# EAGLE schematic pandashield12-lga (EAGLE 6.0)

## Sheet 1 of 9
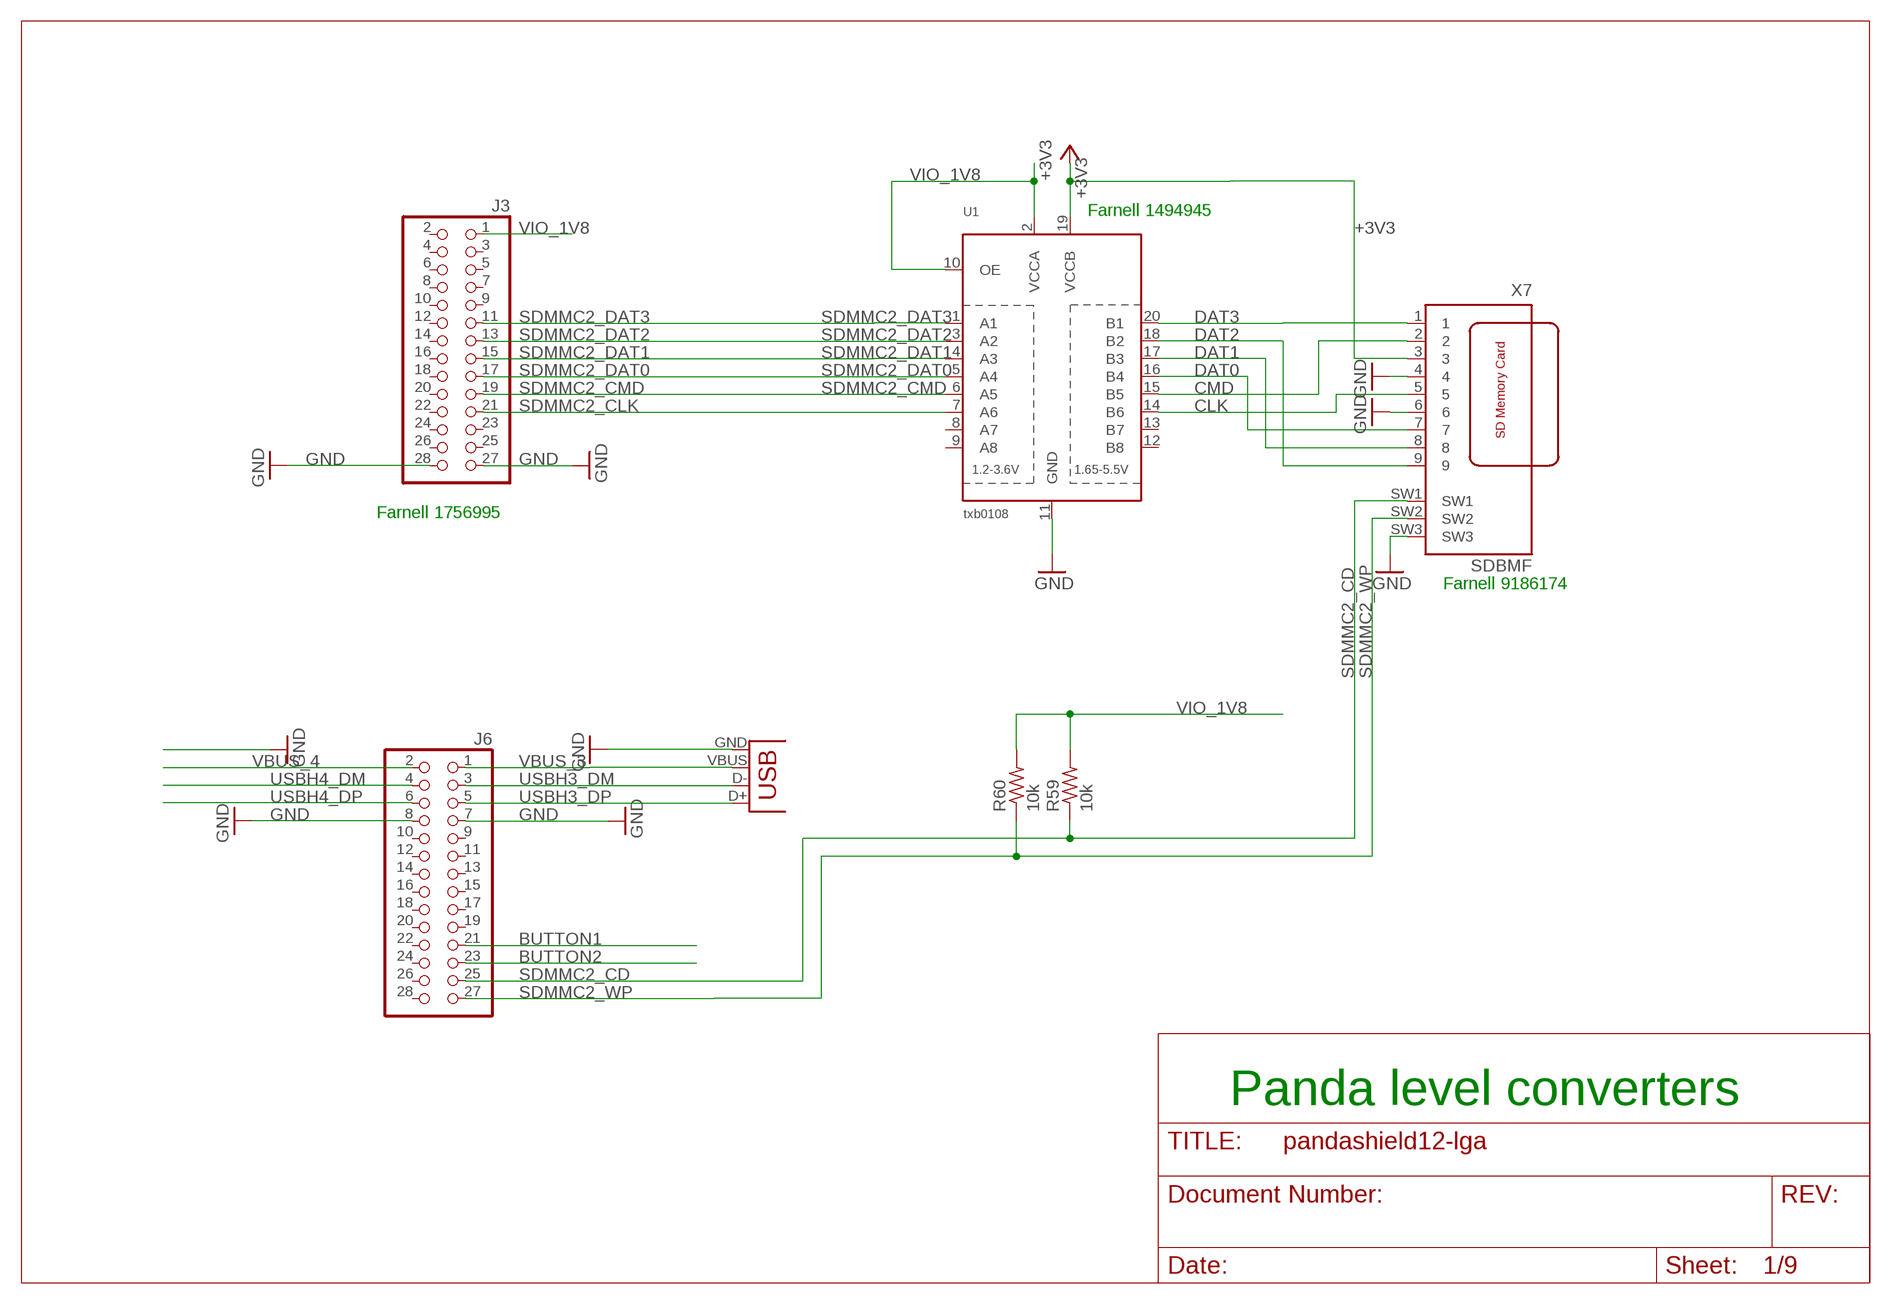
[diagram p0: schematic, sheet 1]

### Parts
J3  PINHD-2X14  [2X14]
J6  PINHD-2X14  [2X14]
R59  10k  R-US_R0603  [R0603]
R60  10k  R-US_R0603  [R0603]
U1  txb0108  TXB0108PWR  [TSSOP20]
X4  USB-A-S  [USB-A-S]
X7  SDBMF  [SDBMF-009XXBXX2]

### Nets
+3V3 [morepower]: U1.19(VCCB) X7.3 ; also sheet 2,4,5,6,7,8
BUTTON1: J6.21
BUTTON2: J6.23
CLK: U1.14(B6) X7.5
CMD: U1.15(B5) X7.2
DAT0: U1.16(B4) X7.7
DAT1: U1.17(B3) X7.8
DAT2: U1.18(B2) X7.9
DAT3: U1.20(B1) X7.1
GND [morepower]: J3.27 J3.28 J6.7 J6.8 U1.11(GND) X4.GND X7.4 X7.6 X7.SW3 ; also sheet 2,3,4,5,6,7,8,9
SDMMC2_CD: J6.25 R59.1 X7.SW1
SDMMC2_CLK: J3.21 U1.7(A6)
SDMMC2_CMD: J3.19 U1.6(A5)
SDMMC2_DAT0: J3.17 U1.5(A4)
SDMMC2_DAT1: J3.15 U1.4(A3)
SDMMC2_DAT2: J3.13 U1.3(A2)
SDMMC2_DAT3: J3.11 U1.1(A1)
SDMMC2_WP: J6.27 R60.1 X7.SW2
USBH3_DM: J6.3 X4.D-
USBH3_DP: J6.5 X4.D+
USBH4_DM: J6.4
USBH4_DP: J6.6
VBUS_3 [power]: J6.1 X4.VBUS
VBUS_4 [power]: J6.2
VIO_1V8 [power]: J3.1 R59.2 R60.2 U1.2(VCCA) U1.10(OE)
Unconnected: J3.2 J3.3 J3.4 J3.5 J3.6 J3.7 J3.8 J3.9 J3.10 J3.12 J3.14 J3.16 J3.18 J3.20 J3.22 J3.23 J3.24 J3.25 J3.26 J6.9 J6.10 J6.11 J6.12 J6.13 J6.14 J6.15 J6.16 J6.17 J6.18 J6.19 J6.20 J6.22 J6.24 J6.26 J6.28 U1.8(A7) U1.9(A8) U1.12(B8) U1.13(B7)

### Notes on the sheet
- Farnell 1494945
- Farnell 1756995
- Farnell 9186174
- Panda level converters

## Sheet 2 of 9
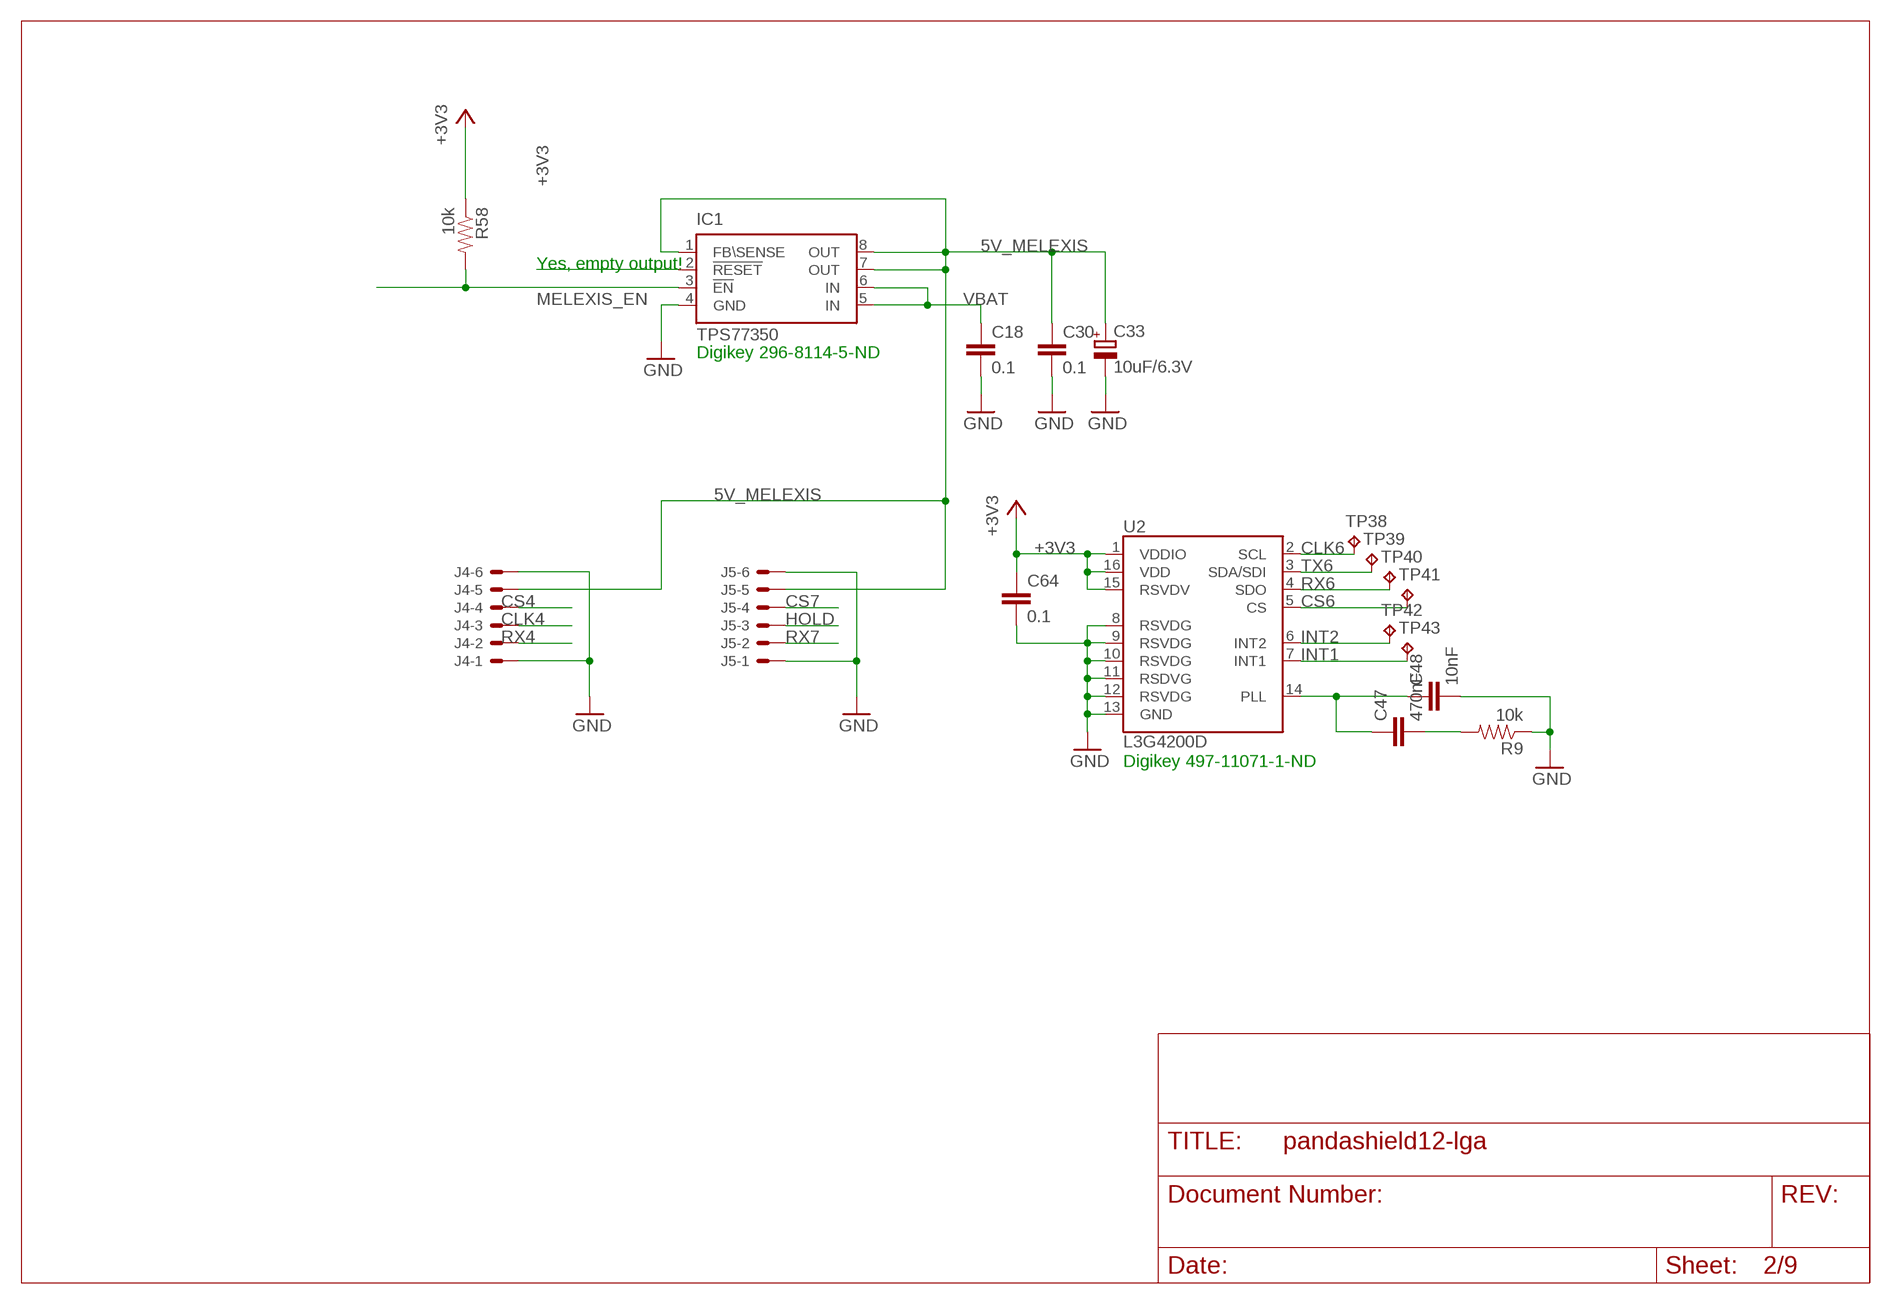
[diagram p1: schematic, sheet 2]

### Parts
C18  0.1  C-EUC0603  [C0603]
C30  0.1  C-EUC0603  [C0603]
C33  10uF/6.3V  CPOL-EUC/6032-28R  [C/6032-28R]
C47  470nF  CAP0603-CAP  [0603-CAP]
C48  10nF  CAP0603-CAP  [0603-CAP]
C64  0.1  CAP0603-CAP  [0603-CAP]
IC1  TPS77350  [SOP-08]
J4  XF2L-0625-1  [XF2L-0625-1]
J5  XF2L-0625-1  [XF2L-0625-1]
R9  10k  RESISTOR0603-RES  [0603-RES]
R58  10k  RESISTOR0603-RES  [0603-RES]
TP38  TPB1,27  [B1,27]
TP39  TPB1,27  [B1,27]
TP40  TPB1,27  [B1,27]
TP41  TPB1,27  [B1,27]
TP42  TPB1,27  [B1,27]
TP43  TPB1,27  [B1,27]
U2  L3G4200D  [LGA16-4X4]

### Nets
5V_MELEXIS [power]: C30.1 C33.+ IC1.1(FB\SENSE) IC1.7(OUT) IC1.8(OUT) J4.5 J5.5
+3V3 [morepower]: C64.1 R58.1 U2.1(VDDIO) U2.15(RSVDV) U2.16(VDD) ; also sheet 1,4,5,6,7,8
CLK4: J4.3 ; also sheet 6
CLK6: TP38.TP U2.2(SCL) ; also sheet 6
CS4: J4.4 ; also sheet 6
CS6: TP41.TP U2.5(CS) ; also sheet 6
CS7: J5.4 ; also sheet 6
GND [morepower]: C18.2 C30.2 C33.- C48.2 C64.2 IC1.4(GND) J4.1 J4.6 J5.1 J5.6 R9.1 U2.8(RSVDG) U2.9(RSVDG) U2.10(RSVDG) U2.11(RSDVG) U2.12(RSVDG) U2.13(GND) ; also sheet 1,3,4,5,6,7,8,9
HOLD: J5.3 ; also sheet 6
INT1: TP43.TP U2.7(INT1) ; also sheet 6
INT2: TP42.TP U2.6(INT2) ; also sheet 6
MELEXIS_EN: IC1.3(!EN) R58.2 ; also sheet 6
N$3: C47.1 C48.1 U2.14(PLL)
N$4: C47.2 R9.2
N$9: IC1.2(!RESET)
RX4: J4.2 ; also sheet 6
RX6: TP40.TP U2.4(SDO) ; also sheet 6
RX7: J5.2 ; also sheet 6
TX6: TP39.TP U2.3(SDA/SDI) ; also sheet 6
VBAT [morepower]: C18.1 IC1.5(IN) IC1.6(IN) ; also sheet 3,4,5,6,7,9

### Notes on the sheet
- Yes, empty output!
- Digikey 296-8114-5-ND
- Digikey 497-11071-1-ND

## Sheet 3 of 9
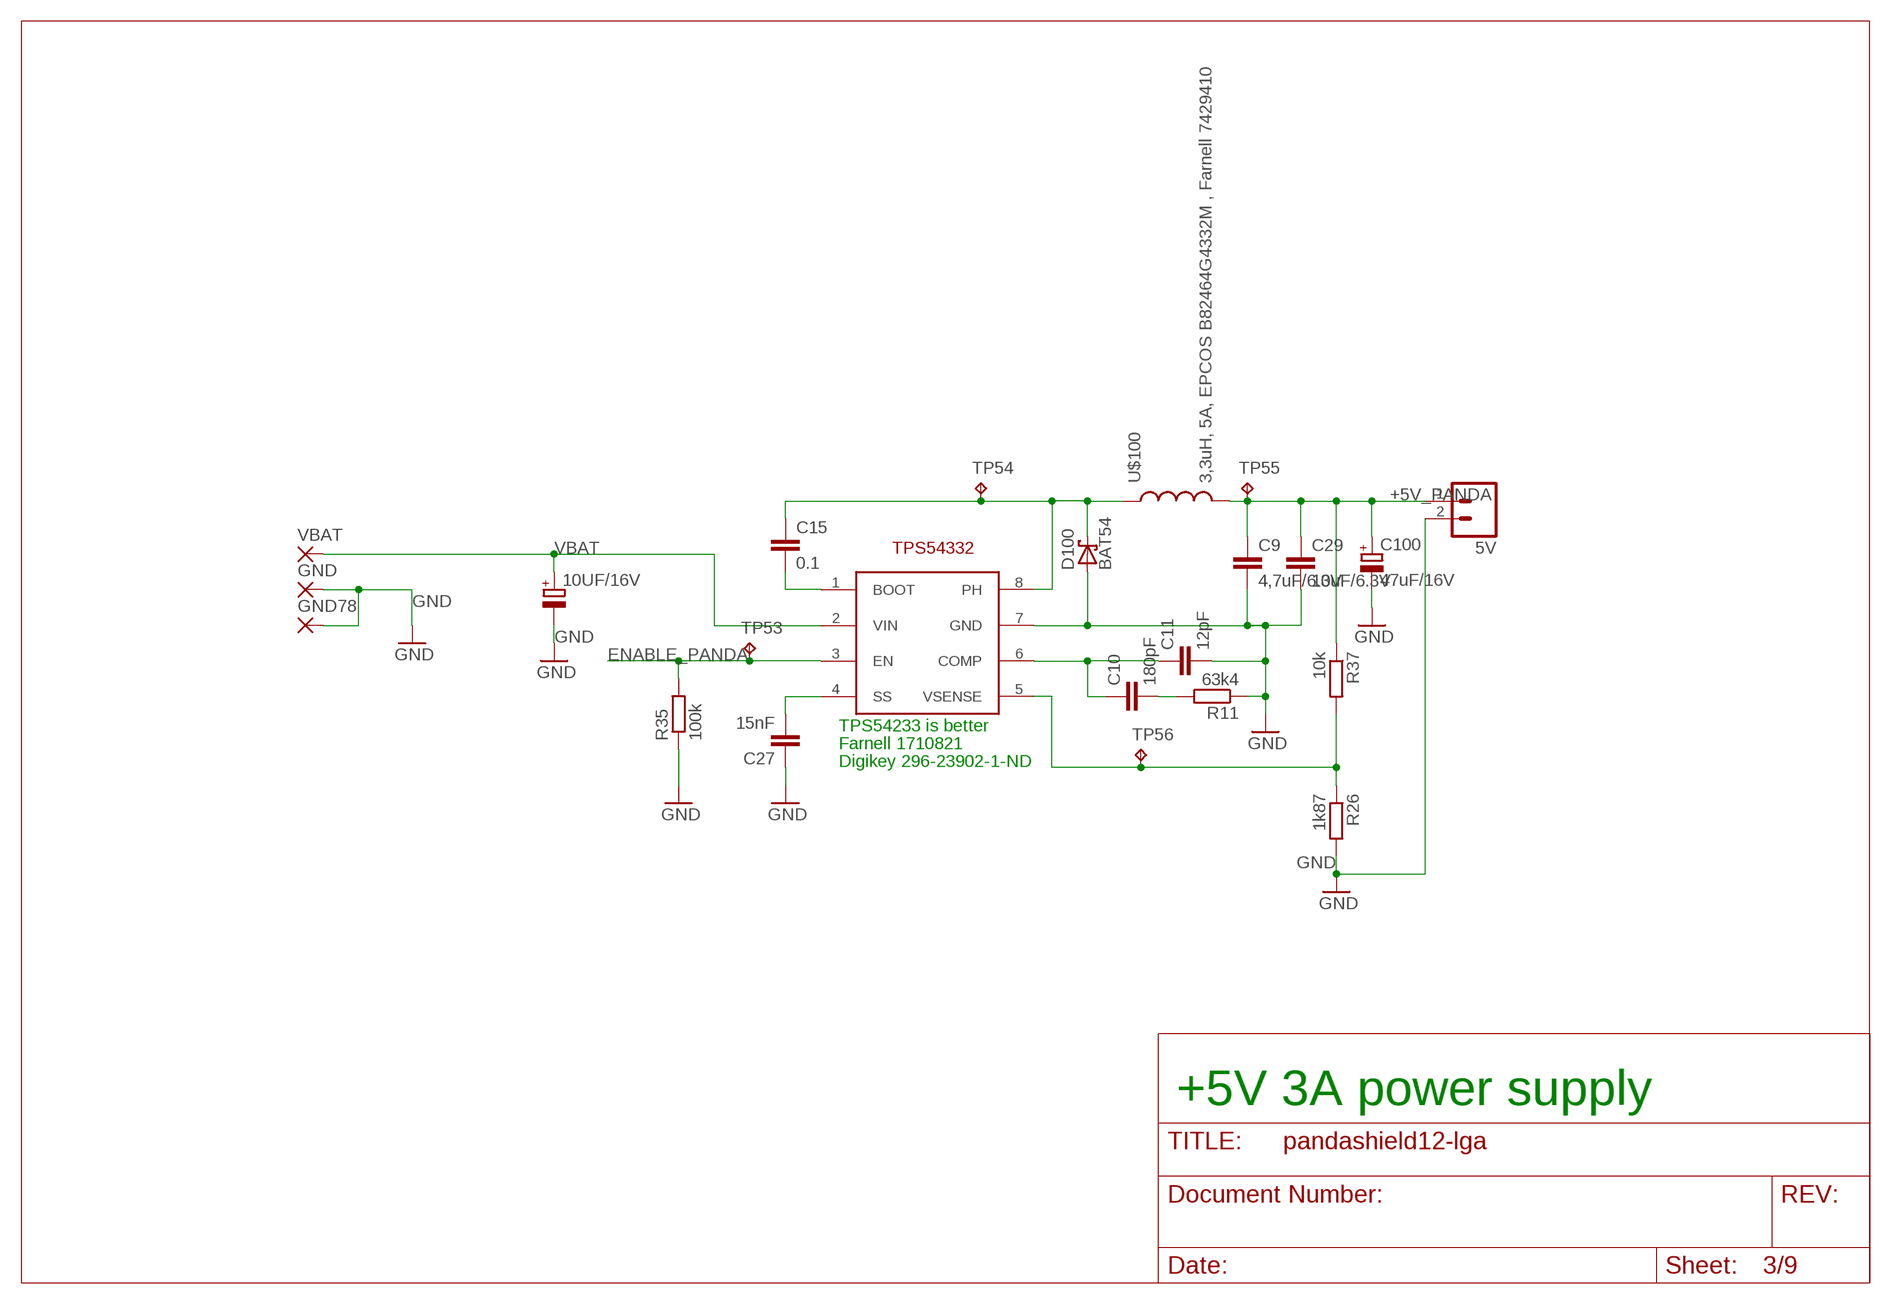
[diagram p2: schematic, sheet 3]

### Parts
5V  M02  [02P]
10UF/16V  CPOL-EUC/6032-28R  [C/6032-28R]
C9  4,7uF/6.3V  C-EUC0805  [C0805]
C10  180pF  C-EUC0805K  [C0805K]
C11  12pF  C-EUC0805K  [C0805K]
C15  0.1  C-EUC0805K  [C0805K]
C27  15nF  C-EUC0805K  [C0805K]
C29  10uF/6.3V  CAP1210  [1210]
C100  47uF/16V  CPOL-EUC/6032-28R  [C/6032-28R]
D100  BAT54  [SOT23]
GND  3,81/1,4  [3,81/1,4]
GND78  3,81/1,4  [3,81/1,4]
R11  63k4  R-EU_R0805  [R0805]
R26  1k87  R-EU_R0805  [R0805]
R35  100k  R-EU_R0805  [R0805]
R37  10k  R-EU_R0805  [R0805]
TP53  TPB1,27  [B1,27]
TP54  TPB1,27  [B1,27]
TP55  TPB1,27  [B1,27]
TP56  TPB1,27  [B1,27]
U$3  TPS54233  TPS54332  [SO8]
U$100  3,3uH, 5A, EPCOS B82464G4332M , Farnell 7429410  INDUCTORCR54  [CR54]
VBAT  3,81/1,4  [3,81/1,4]

### Nets
+5V_PANDA [morepower]: 5V.1 C9.1 C29.1 C100.+ R37.1 TP55.TP U$100.P$2
ENABLE_PANDA: R35.2 TP53.TP U$3.3(EN) ; also sheet 6
GND [morepower]: 5V.2 10UF/16V.- C9.2 C11.2 C27.1 C29.2 C100.- D100.1(A) GND78.1(P) GND.1(P) R11.1 R26.2 R35.1 U$3.7(GND) ; also sheet 1,2,4,5,6,7,8,9
N$6: C10.1 C11.1 U$3.6(COMP)
N$18: C10.2 R11.2
N$20: C27.2 U$3.4(SS)
N$30: C15.2 U$3.1(BOOT)
N$32: R26.1 R37.2 TP56.TP U$3.5(VSENSE)
N$33 [morepower]: C15.1 D100.3(C) TP54.TP U$3.8(PH) U$100.P$1
VBAT [morepower]: 10UF/16V.+ U$3.2(VIN) VBAT.1(P) ; also sheet 2,4,5,6,7,9

### Notes on the sheet
- TPS54233 is better
- Farnell 1710821
- Digikey 296-23902-1-ND
- +5V 3A power supply

## Sheet 4 of 9
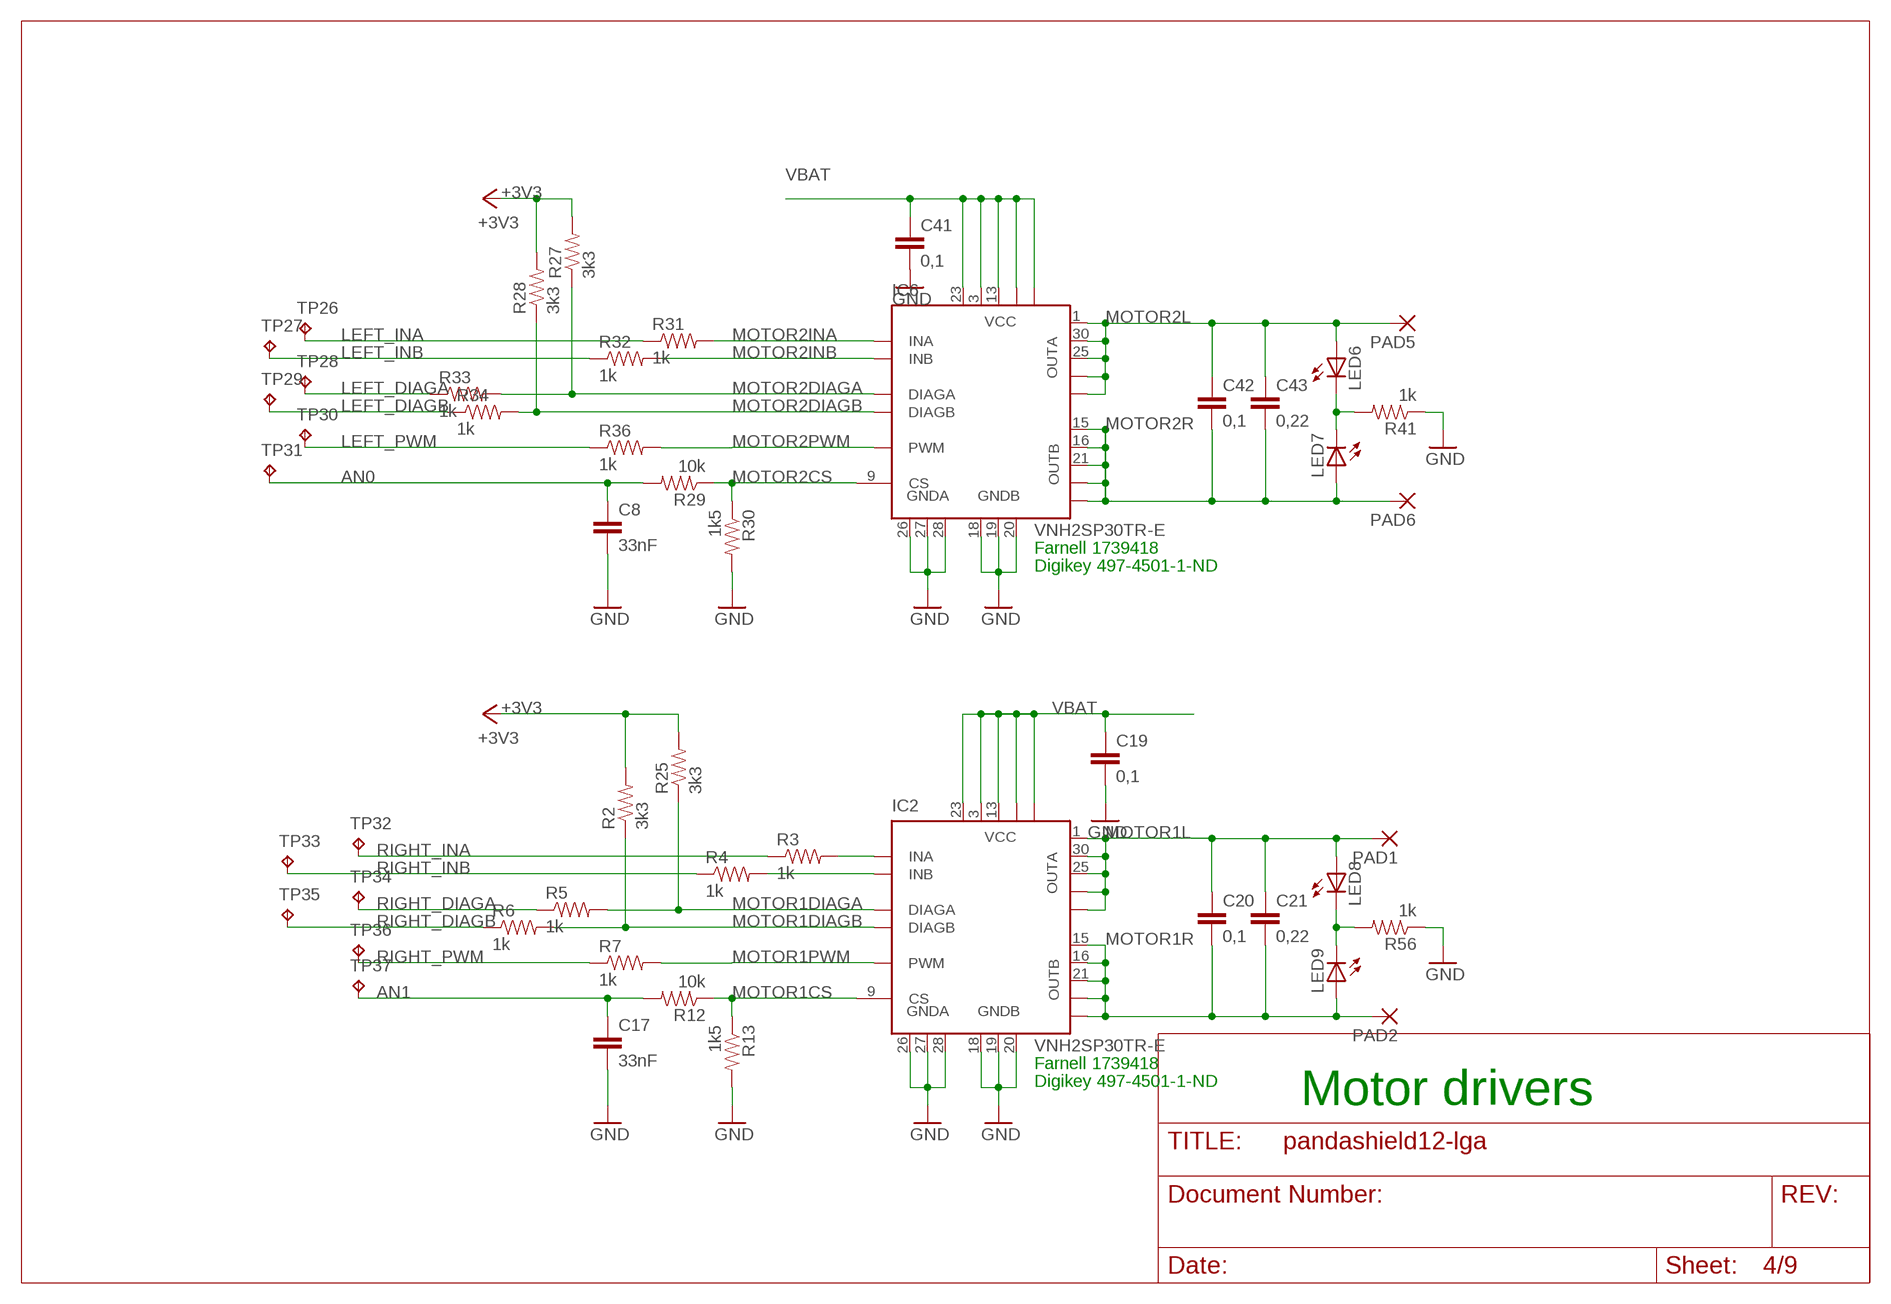
[diagram p3: schematic, sheet 4]

### Parts
C8  33nF  CAP0603-CAP  [0603-CAP]
C17  33nF  CAP0603-CAP  [0603-CAP]
C19  0,1  CAP0603-CAP  [0603-CAP]
C20  0,1  CAP0603-CAP  [0603-CAP]
C21  0,22  CAP0603-CAP  [0603-CAP]
C41  0,1  CAP0603-CAP  [0603-CAP]
C42  0,1  CAP0603-CAP  [0603-CAP]
C43  0,22  CAP0603-CAP  [0603-CAP]
IC2  VNH2SP30TR-E  VNH3ASP30-E  [MULTIPOWERSO-30]
IC6  VNH2SP30TR-E  VNH3ASP30-E  [MULTIPOWERSO-30]
LED6  LEDCHIP-LED0603  [CHIP-LED0603]
LED7  LEDCHIP-LED0603  [CHIP-LED0603]
LED8  LEDCHIP-LED0603  [CHIP-LED0603]
LED9  LEDCHIP-LED0603  [CHIP-LED0603]
PAD1  3,81/1,4  [3,81/1,4]
PAD2  3,81/1,4  [3,81/1,4]
PAD5  3,81/1,4  [3,81/1,4]
PAD6  3,81/1,4  [3,81/1,4]
R2  3k3  RESISTOR0603-RES  [0603-RES]
R3  1k  RESISTOR0603-RES  [0603-RES]
R4  1k  RESISTOR0603-RES  [0603-RES]
R5  1k  RESISTOR0603-RES  [0603-RES]
R6  1k  RESISTOR0603-RES  [0603-RES]
R7  1k  RESISTOR0603-RES  [0603-RES]
R12  10k  RESISTOR0603-RES  [0603-RES]
R13  1k5  RESISTOR0603-RES  [0603-RES]
R25  3k3  RESISTOR0603-RES  [0603-RES]
R27  3k3  RESISTOR0603-RES  [0603-RES]
R28  3k3  RESISTOR0603-RES  [0603-RES]
R29  10k  RESISTOR0603-RES  [0603-RES]
R30  1k5  RESISTOR0603-RES  [0603-RES]
R31  1k  RESISTOR0603-RES  [0603-RES]
R32  1k  RESISTOR0603-RES  [0603-RES]
R33  1k  RESISTOR0603-RES  [0603-RES]
R34  1k  RESISTOR0603-RES  [0603-RES]
R36  1k  RESISTOR0603-RES  [0603-RES]
R41  1k  RESISTOR0603-RES  [0603-RES]
R56  1k  RESISTOR0603-RES  [0603-RES]
TP26  TPB1,27  [B1,27]
TP27  TPB1,27  [B1,27]
TP28  TPB1,27  [B1,27]
TP29  TPB1,27  [B1,27]
TP30  TPB1,27  [B1,27]
TP31  TPB1,27  [B1,27]
TP32  TPB1,27  [B1,27]
TP33  TPB1,27  [B1,27]
TP34  TPB1,27  [B1,27]
TP35  TPB1,27  [B1,27]
TP36  TPB1,27  [B1,27]
TP37  TPB1,27  [B1,27]

### Nets
+3V3 [morepower]: R2.2 R25.2 R27.2 R28.2 ; also sheet 1,2,5,6,7,8
AN0: C8.1 R29.2 TP31.TP ; also sheet 6
AN1: C17.1 R12.2 TP37.TP ; also sheet 6
GND [morepower]: C8.2 C17.2 C19.2 C41.2 IC2.18(GNDB) IC2.19(GNDB) IC2.20(GNDB) IC2.26(GNDA) IC2.27(GNDA) IC2.28(GNDA) IC6.18(GNDB) IC6.19(GNDB) IC6.20(GNDB) IC6.26(GNDA) IC6.27(GNDA) IC6.28(GNDA) R13.2 R30.2 R41.1 R56.1 ; also sheet 1,2,3,5,6,7,8,9
LEFT_DIAGA: R33.1 TP28.TP ; also sheet 6
LEFT_DIAGB: R34.1 TP29.TP ; also sheet 6
LEFT_INA: R31.1 TP26.TP ; also sheet 6
LEFT_INB: R32.1 TP27.TP ; also sheet 6
LEFT_PWM: R36.1 TP30.TP ; also sheet 6
MOTOR1CS: IC2.9(CS) R12.1 R13.1
MOTOR1DIAGA: IC2.6(DIAGA) R5.2 R25.1
MOTOR1DIAGB: IC2.10(DIAGB) R2.1 R6.2
MOTOR1INA: IC2.5(INA) R3.2
MOTOR1INB: IC2.11(INB) R4.2
MOTOR1L [morepower]: C20.1 C21.1 IC2.1(OUTA) IC2.25(OUTA) IC2.30(OUTA) IC2.OUTA IC2.OUTA@1(OUTA) LED8.A PAD1.1(P) ; also sheet 9
MOTOR1PWM: IC2.8(PWM) R7.2
MOTOR1R [morepower]: C20.2 C21.2 IC2.15(OUTB) IC2.16(OUTB) IC2.21(OUTB) IC2.OUTB IC2.OUTB@1(OUTB) LED9.A PAD2.1(P) ; also sheet 9
MOTOR2CS: IC6.9(CS) R29.1 R30.1
MOTOR2DIAGA: IC6.6(DIAGA) R27.1 R33.2
MOTOR2DIAGB: IC6.10(DIAGB) R28.1 R34.2
MOTOR2INA: IC6.5(INA) R31.2
MOTOR2INB: IC6.11(INB) R32.2
MOTOR2L [morepower]: C42.1 C43.1 IC6.1(OUTA) IC6.25(OUTA) IC6.30(OUTA) IC6.OUTA IC6.OUTA@1(OUTA) LED6.A PAD5.1(P) ; also sheet 9
MOTOR2PWM: IC6.8(PWM) R36.2
MOTOR2R [morepower]: C42.2 C43.2 IC6.15(OUTB) IC6.16(OUTB) IC6.21(OUTB) IC6.OUTB IC6.OUTB@1(OUTB) LED7.A PAD6.1(P) ; also sheet 9
N$12: LED6.C LED7.C R41.2
N$14: LED8.C LED9.C R56.2
RIGHT_DIAGA: R5.1 TP34.TP ; also sheet 6
RIGHT_DIAGB: R6.1 TP35.TP ; also sheet 6
RIGHT_INA: R3.1 TP32.TP ; also sheet 6
RIGHT_INB: R4.1 TP33.TP ; also sheet 6
RIGHT_PWM: R7.1 TP36.TP ; also sheet 6
VBAT [morepower]: C19.1 C41.1 IC2.3(VCC) IC2.13(VCC) IC2.23(VCC) IC2.VCC IC2.VCC@1(VCC) IC6.3(VCC) IC6.13(VCC) IC6.23(VCC) IC6.VCC IC6.VCC@1(VCC) ; also sheet 2,3,5,6,7,9

### Notes on the sheet
- Farnell 1739418
- Digikey 497-4501-1-ND
- Farnell 1739418
- Digikey 497-4501-1-ND
- Motor drivers

## Sheet 5 of 9
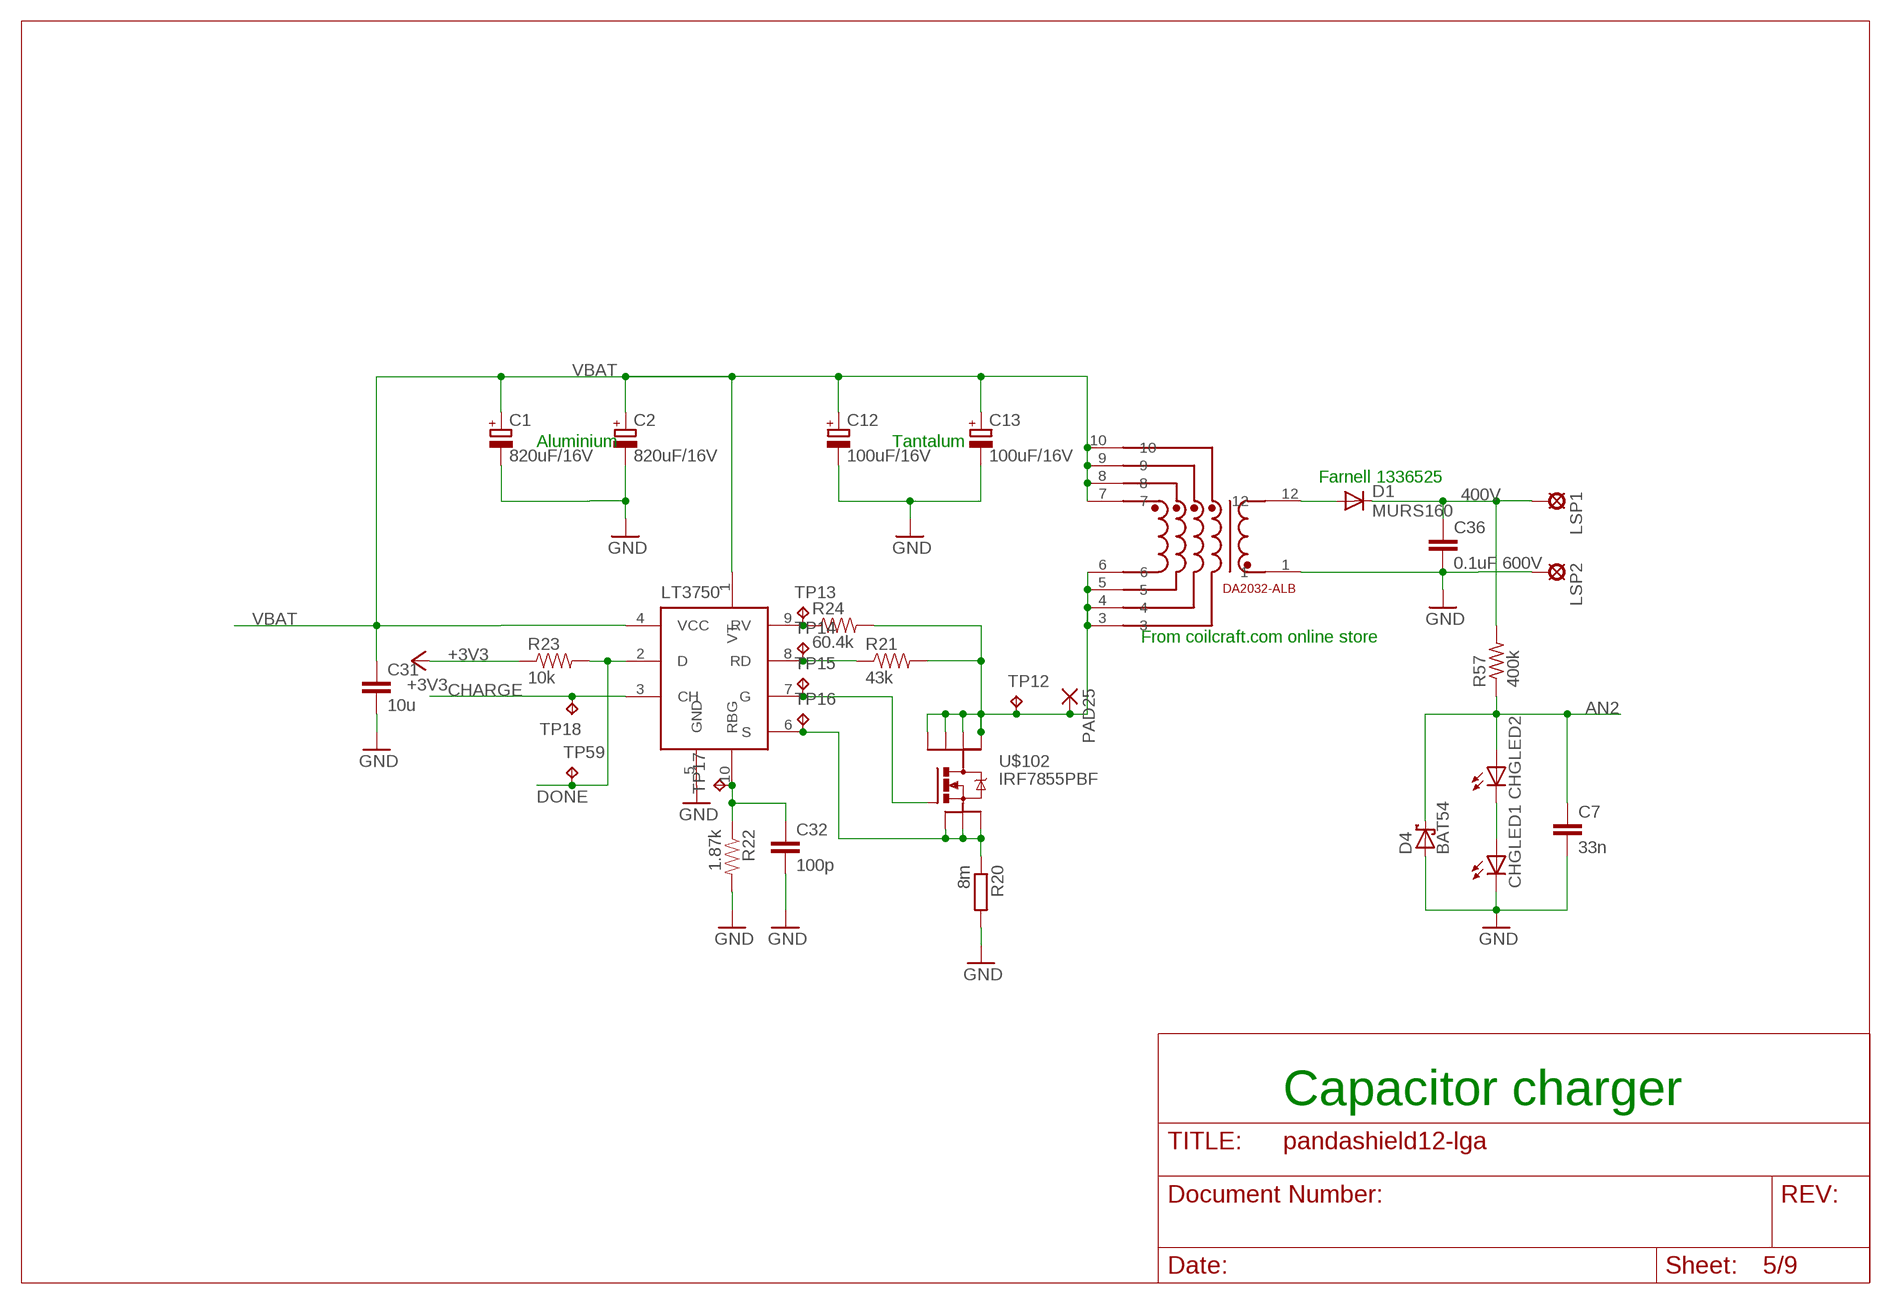
[diagram p4: schematic, sheet 5]

### Parts
C1  820uF/16V  CPOL-EU153CLV-1014  [153CLV-1014]
C2  820uF/16V  CPOL-EU153CLV-1014  [153CLV-1014]
C7  33n  CAP0603-CAP  [0603-CAP]
C12  100uF/16V  CPOL-EUC/6032-28R  [C/6032-28R]
C13  100uF/16V  CPOL-EUC/6032-28R  [C/6032-28R]
C31  10u  C-EUC1210  [C1210]
C32  100p  CAP0603-CAP  [0603-CAP]
C36  0.1uF 600V  C-EUC1812  [C1812]
CHGLED1  LEDCHIPLED_0603  [CHIPLED_0603]
CHGLED2  LEDCHIPLED_0603  [CHIPLED_0603]
D1  MURS160  ES2D  [SMB]
D4  BAT54  [SOT23]
LSP1  LSP11  [LSP11]
LSP2  LSP11  [LSP11]
LT3750  LT3750  [MSOP]
PAD25  1,6/0,9  [1,6/0,9]
R20  8m  R-EU_R1210  [R1210]
R21  43k  RESISTOR0603-RES  [0603-RES]
R22  1.87k  RESISTOR0603-RES  [0603-RES]
R23  10k  RESISTOR0603-RES  [0603-RES]
R24  60.4k  RESISTOR0603-RES  [0603-RES]
R57  400k  R-US_R1210  [R1210]
TP12  TPB1,27  [B1,27]
TP13  TPB1,27  [B1,27]
TP14  TPB1,27  [B1,27]
TP15  TPB1,27  [B1,27]
TP16  TPB1,27  [B1,27]
TP17  TPB1,27  [B1,27]
TP18  TPB1,27  [B1,27]
TP59  TPB1,27  [B1,27]
U$1  DA2032-ALBDA2032-ALB  [DA2032-ALB]
U$102  IRF7855PBF  IRF8252  [SO8]

### Nets
400V [morepower]: C36.1 D1.C LSP1.MP R57.2
+3V3 [morepower]: R23.1 ; also sheet 1,2,4,6,7,8
AN2: C7.1 CHGLED2.A D4.3(C) R57.1 ; also sheet 6
CHARGE: LT3750.3(CH) TP18.TP ; also sheet 6
DONE: LT3750.2(D) R23.2 TP59.TP ; also sheet 6
GND [morepower]: C1.- C2.- C7.2 C12.- C13.- C31.2 C32.2 C36.2 CHGLED1.C D4.1(A) LSP2.MP LT3750.5(GND) R20.2 R22.2 U$1.1 ; also sheet 1,2,3,4,6,7,8,9
N$17: CHGLED1.A CHGLED2.C
N$71 [morepower]: D1.A U$1.12
N$72: LT3750.7(G) TP15.TP U$102.4(G)
N$73: LT3750.9(RV) R24.1 TP13.TP
N$74: LT3750.8(RD) R21.1 TP14.TP
N$75 [morepower]: PAD25.1(P) R21.2 R24.2 TP12.TP U$1.3 U$1.4 U$1.5 U$1.6 U$102.5(D) U$102.6(D) U$102.7(D) U$102.8(D)
N$76 [morepower]: LT3750.6(S) R20.1 TP16.TP U$102.1(S) U$102.2(S) U$102.3(S)
N$78: C32.1 LT3750.10(RBG) R22.1 TP17.TP
VBAT [morepower]: C1.+ C2.+ C12.+ C13.+ C31.1 LT3750.1(VT) LT3750.4(VCC) U$1.7 U$1.8 U$1.9 U$1.10 ; also sheet 2,3,4,6,7,9

### Notes on the sheet
- Aluminium | Tantalum
- Farnell 1336525
- From coilcraft.com online store
- Capacitor charger

## Sheet 6 of 9
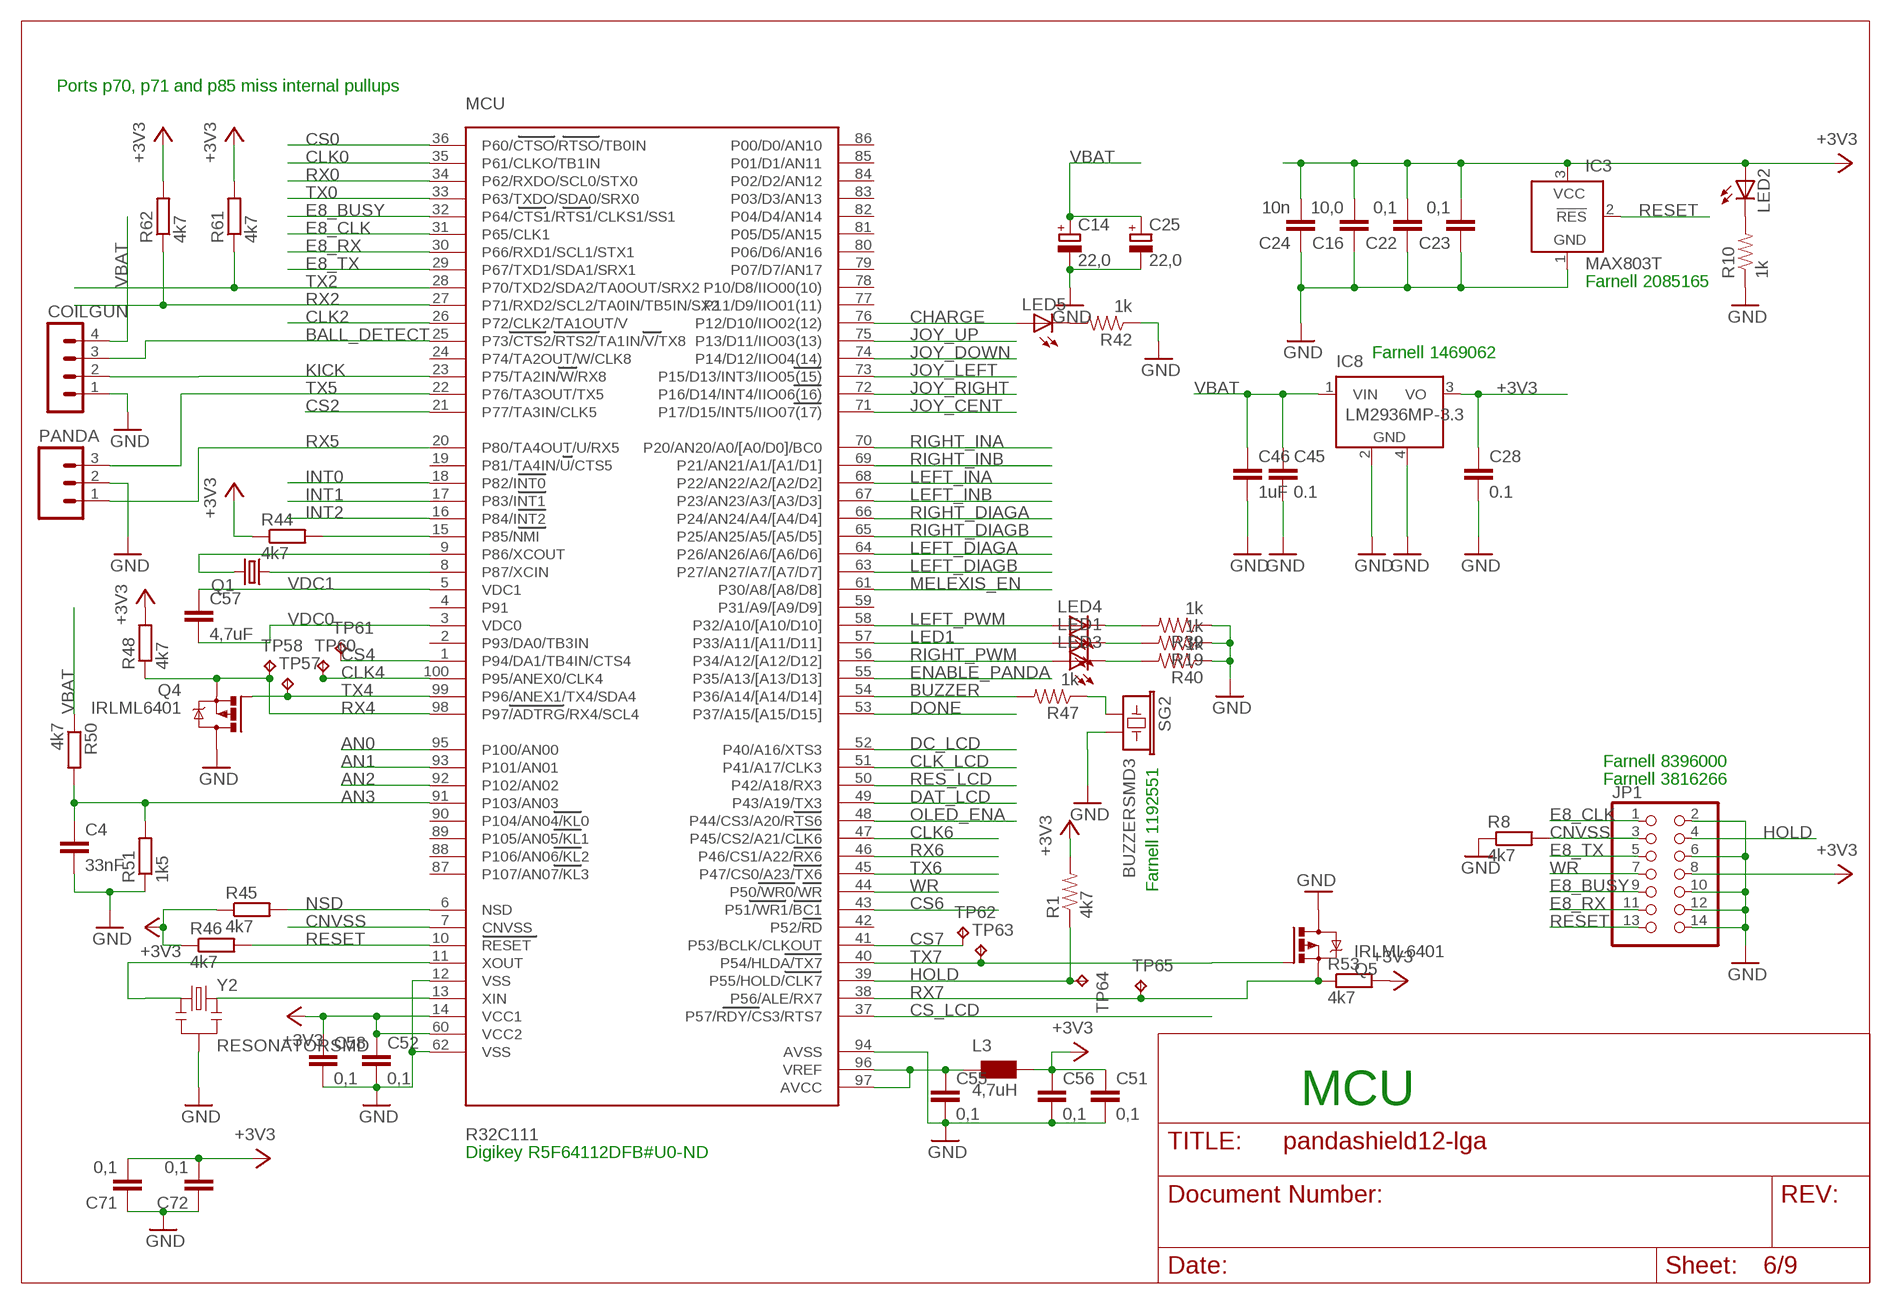
[diagram p5: schematic, sheet 6]

### Parts
C4  33nF  C-EUC0603  [C0603]
C14  22,0  CPOL-EUSMCC  [SMC_C]
C16  10,0  C-EUC1210  [C1210]
C22  0,1  C-EUC0603  [C0603]
C23  0,1  C-EUC0603  [C0603]
C24  10n  C-EUC0603  [C0603]
C25  22,0  CPOL-EUSMCC  [SMC_C]
C28  0.1  CAP0603-CAP  [0603-CAP]
C45  0.1  CAP0603-CAP  [0603-CAP]
C46  1uF  CAP0603-CAP  [0603-CAP]
C51  0,1  C-EUC0603  [C0603]
C52  0,1  C-EUC0603  [C0603]
C55  0,1  C-EUC0603  [C0603]
C56  0,1  C-EUC0603  [C0603]
C57  4,7uF  C-EUC0805K  [C0805K]
C58  0,1  C-EUC0603  [C0603]
C71  0,1  C-EUC0603  [C0603]
C72  0,1  C-EUC0603  [C0603]
COILGUN  MA04-1  [MA04-1]
IC3  MAX803T  TCM809  [SOT23B-3]
IC8  LM2936MP-3.3  LM2936MP-3.0  [SOT223]
JP1  PINHD-2X7  [2X07]
L3  4,7uH  WE-KIHQ_0805  [WE-KI_0805_B]
LED1  LEDCHIP-LED0603  [CHIP-LED0603]
LED2  LEDCHIP-LED0603  [CHIP-LED0603]
LED3  LEDCHIP-LED0603  [CHIP-LED0603]
LED4  LEDCHIP-LED0603  [CHIP-LED0603]
LED5  LEDCHIP-LED0603  [CHIP-LED0603]
MCU  R32C111  [100P6Q-A]
PANDA  MA03  [03P]
Q1  CRYSTALMM20SS  [MM20SS]
Q4  IRLML6401  IRLML5203  [MICRO3]
Q5  IRLML6401  IRLML5203  [MICRO3]
R1  4k7  RESISTOR0603-RES  [0603-RES]
R8  4k7  R-EU_R0603  [R0603]
R10  1k  RESISTOR0603-RES  [0603-RES]
R19  1k  RESISTOR0603-RES  [0603-RES]
R39  1k  RESISTOR0603-RES  [0603-RES]
R40  1k  RESISTOR0603-RES  [0603-RES]
R42  1k  RESISTOR0603-RES  [0603-RES]
R44  4k7  R-EU_R0603  [R0603]
R45  4k7  R-EU_R0603  [R0603]
R46  4k7  R-EU_R0603  [R0603]
R47  1k  RESISTOR0603-RES  [0603-RES]
R48  4k7  R-EU_R0603  [R0603]
R50  4k7  R-EU_R0603  [R0603]
R51  1k5  R-EU_R0603  [R0603]
R53  4k7  R-EU_R0603  [R0603]
R61  4k7  R-EU_R0603  [R0603]
R62  4k7  R-EU_R0603  [R0603]
SG2  BUZZERSMD3  [BUZZER-CMT1102]
TP57  TPB1,27  [B1,27]
TP58  TPB1,27  [B1,27]
TP60  TPB1,27  [B1,27]
TP61  TPB1,27  [B1,27]
TP62  TPB1,27  [B1,27]
TP63  TPB1,27  [B1,27]
TP64  TPB1,27  [B1,27]
TP65  TPB1,27  [B1,27]
Y2  RESONATORSMD  [RESONATOR-SMD]

### Nets
+3V3 [morepower]: C16.2 C22.2 C23.2 C24.2 C28.1 C51.1 C52.1 C56.1 C58.1 C71.2 C72.2 IC3.3(VCC) IC8.3(VO) JP1.8 L3.1 LED2.A MCU.14(VCC1) MCU.60(VCC2) R1.2 R44.1 R45.1 R46.1 R48.2 R53.2 R61.2 R62.2 ; also sheet 1,2,4,5,7,8
AN0: MCU.95(P100/AN00) ; also sheet 4
AN1: MCU.93(P101/AN01) ; also sheet 4
AN2: MCU.92(P102/AN02) ; also sheet 5
AN3: C4.1 MCU.91(P103/AN03) R50.2 R51.2
BALL_DETECT: COILGUN.3 MCU.25(P73/CTS2/RTS2/TA1IN/V/TX8)
BUZZER: MCU.54(P36/A14/[A14/D14]) R47.2
CHARGE: LED5.A MCU.76(P12/D10/IIO02(12)) ; also sheet 5
CLK0: MCU.35(P61/CLKO/TB1IN) ; also sheet 8
CLK2: MCU.26(P72/CLK2/TA1OUT/V) ; also sheet 8
CLK4: MCU.100(P95/ANEX0/CLK4) TP60.TP ; also sheet 2
CLK6: MCU.47(P45/CS2/A21/CLK6) ; also sheet 2
CLK_LCD: MCU.51(P41/A17/CLK3) ; also sheet 7
CNVSS: JP1.3 MCU.7(CNVSS) R8.2
CS0: MCU.36(P60/CTSO/RTSO/TB0IN) ; also sheet 8
CS2: MCU.21(P77/TA3IN/CLK5) ; also sheet 8
CS4: MCU.1(P94/DA1/TB4IN/CTS4) TP61.TP ; also sheet 2
CS6: MCU.43(P51/WR1/BC1) ; also sheet 2
CS7: MCU.41(P53/BCLK/CLKOUT) TP62.TP ; also sheet 2
CS_LCD: MCU.37(P57/RDY/CS3/RTS7) ; also sheet 7
DAT_LCD: MCU.49(P43/A19/TX3) ; also sheet 7
DC_LCD: MCU.52(P40/A16/XTS3) ; also sheet 7
DONE: MCU.53(P37/A15/[A15/D15]) ; also sheet 5
E8_BUSY: JP1.9 MCU.32(P64/CTS1/RTS1/CLKS1/SS1)
E8_CLK: JP1.1 MCU.31(P65/CLK1)
E8_RX: JP1.11 MCU.30(P66/RXD1/SCL1/STX1)
E8_TX: JP1.5 MCU.29(P67/TXD1/SDA1/SRX1)
ENABLE_PANDA: MCU.55(P35/A13/[A13/D13]) ; also sheet 3
GND [morepower]: C4.2 C14.- C16.1 C22.1 C23.1 C24.1 C25.- C28.2 C45.2 C46.2 C51.2 C52.2 C55.2 C56.2 C58.2 C71.1 C72.1 COILGUN.1 IC3.1(GND) IC8.2(GND) IC8.4(GND) JP1.2 JP1.6 JP1.10 JP1.12 JP1.14 MCU.12(VSS) MCU.62(VSS) MCU.94(AVSS) PANDA.2 Q4.3(D) Q5.3(D) R8.1 R10.1 R19.1 R39.1 R40.1 R42.1 R51.1 SG2.2 Y2.2 ; also sheet 1,2,3,4,5,7,8,9
HOLD: JP1.4 MCU.39(P55/HOLD/CLK7) R1.1 TP64.TP ; also sheet 2
INT0: MCU.18(P82/INT0) ; also sheet 8
INT1: MCU.17(P83/INT1) ; also sheet 2
INT2: MCU.16(P84/INT2) ; also sheet 2
JOY_CENT: MCU.71(P17/D15/INT5/IIO07(17)) ; also sheet 7
JOY_DOWN: MCU.74(P14/D12/IIO04(14)) ; also sheet 7
JOY_LEFT: MCU.73(P15/D13/INT3/IIO05(15)) ; also sheet 7
JOY_RIGHT: MCU.72(P16/D14/INT4/IIO06(16)) ; also sheet 7
JOY_UP: MCU.75(P13/D11/IIO03(13)) ; also sheet 7
KICK: COILGUN.2 MCU.23(P75/TA2IN/W/RX8)
LED1: LED1.A MCU.57(P33/A11/[A11/D11])
LEFT_DIAGA: MCU.64(P26/AN26/A6/[A6/D6]) ; also sheet 4
LEFT_DIAGB: MCU.63(P27/AN27/A7/[A7/D7]) ; also sheet 4
LEFT_INA: MCU.68(P22/AN22/A2/[A2/D2]) ; also sheet 4
LEFT_INB: MCU.67(P23/AN23/A3/[A3/D3]) ; also sheet 4
LEFT_PWM: LED4.A MCU.58(P32/A10/[A10/D10]) ; also sheet 4
MELEXIS_EN: MCU.61(P30/A8/[A8/D8]) ; also sheet 2
N$1: LED3.C R40.2
N$5: LED1.C R19.2
N$7: LED4.C R39.2
N$8: LED5.C R42.2
N$11: R47.1 SG2.1
N$15: MCU.15(P85/NMI) R44.2
N$44: MCU.8(P87/XCIN) Q1.1
N$45: LED2.C R10.2
NSD: MCU.6(NSD) R45.2
OLED_ENA: MCU.48(P44/CS3/A20/RTS6) ; also sheet 7
RES_LCD: MCU.50(P42/A18/RX3) ; also sheet 7
RESET: IC3.2(!RES) JP1.13 MCU.10(RESET) R46.2
RIGHT_DIAGA: MCU.66(P24/AN24/A4/[A4/D4]) ; also sheet 4
RIGHT_DIAGB: MCU.65(P25/AN25/A5/[A5/D5]) ; also sheet 4
RIGHT_INA: MCU.70(P20/AN20/A0/[A0/D0]/BC0) ; also sheet 4
RIGHT_INB: MCU.69(P21/AN21/A1/[A1/D1]) ; also sheet 4
RIGHT_PWM: LED3.A MCU.56(P34/A12/[A12/D12]) ; also sheet 4
RX0: MCU.34(P62/RXDO/SCL0/STX0) ; also sheet 8
RX2: MCU.27(P71/RXD2/SCL2/TA0IN/TB5IN/SX2) R62.1 ; also sheet 8
RX4: MCU.98(P97/ADTRG/RX4/SCL4) Q4.2(S) R48.1 TP58.TP ; also sheet 2
RX5: MCU.20(P80/TA4OUT/U/RX5) PANDA.1
RX6: MCU.46(P46/CS1/A22/RX6) ; also sheet 2
RX7: MCU.38(P56/ALE/RX7) Q5.2(S) R53.1 TP65.TP ; also sheet 2
TX0: MCU.33(P63/TXDO/SDA0/SRX0) ; also sheet 8
TX2: MCU.28(P70/TXD2/SDA2/TA0OUT/SRX2) R61.1 ; also sheet 8
TX4: MCU.99(P96/ANEX1/TX4/SDA4) Q4.1(G) TP57.TP
TX5: MCU.22(P76/TA3OUT/TX5) PANDA.3
TX6: MCU.45(P47/CS0/A23/TX6) ; also sheet 2
TX7: MCU.40(P54/HLDA/TX7) Q5.1(G) TP63.TP
UCREF: C55.1 L3.2 MCU.96(VREF) MCU.97(AVCC)
VBAT [morepower]: C14.+ C25.+ C45.1 C46.1 COILGUN.4 IC8.1(VIN) R50.1 ; also sheet 2,3,4,5,7,9
VDC0: C57.2 MCU.3(VDC0)
VDC1: C57.1 MCU.5(VDC1)
WR: JP1.7 MCU.44(P50/WR0/WR)
XCOUT: MCU.9(P86/XCOUT) Q1.4
XIN: MCU.13(XIN) Y2.3
XOUT: MCU.11(XOUT) Y2.1
Unconnected: MCU.2(P93/DA0/TB3IN) MCU.4(P91) MCU.19(P81/TA4IN/U/CTS5) MCU.24(P74/TA2OUT/W/CLK8) MCU.42(P52/RD) MCU.59(P31/A9/[A9/D9]) MCU.77(P11/D9/IIO01(11)) MCU.78(P10/D8/IIO00(10)) MCU.79(P07/D7/AN17) MCU.80(P06/D6/AN16) MCU.81(P05/D5/AN15) MCU.82(P04/D4/AN14) MCU.83(P03/D3/AN13) MCU.84(P02/D2/AN12) MCU.85(P01/D1/AN11) MCU.86(P00/D0/AN10) MCU.87(P107/AN07/KL3) MCU.88(P106/AN06/KL2) MCU.89(P105/AN05/KL1) MCU.90(P104/AN04/KL0)

### Notes on the sheet
- Ports p70, p71 and p85 miss internal pullups
- Farnell 2085165
- Farnell 1469062
- Farnell 8396000
- Farnell 3816266
- Farnell 1192551
- MCU
- Digikey R5F64112DFB#U0-ND

## Sheet 7 of 9
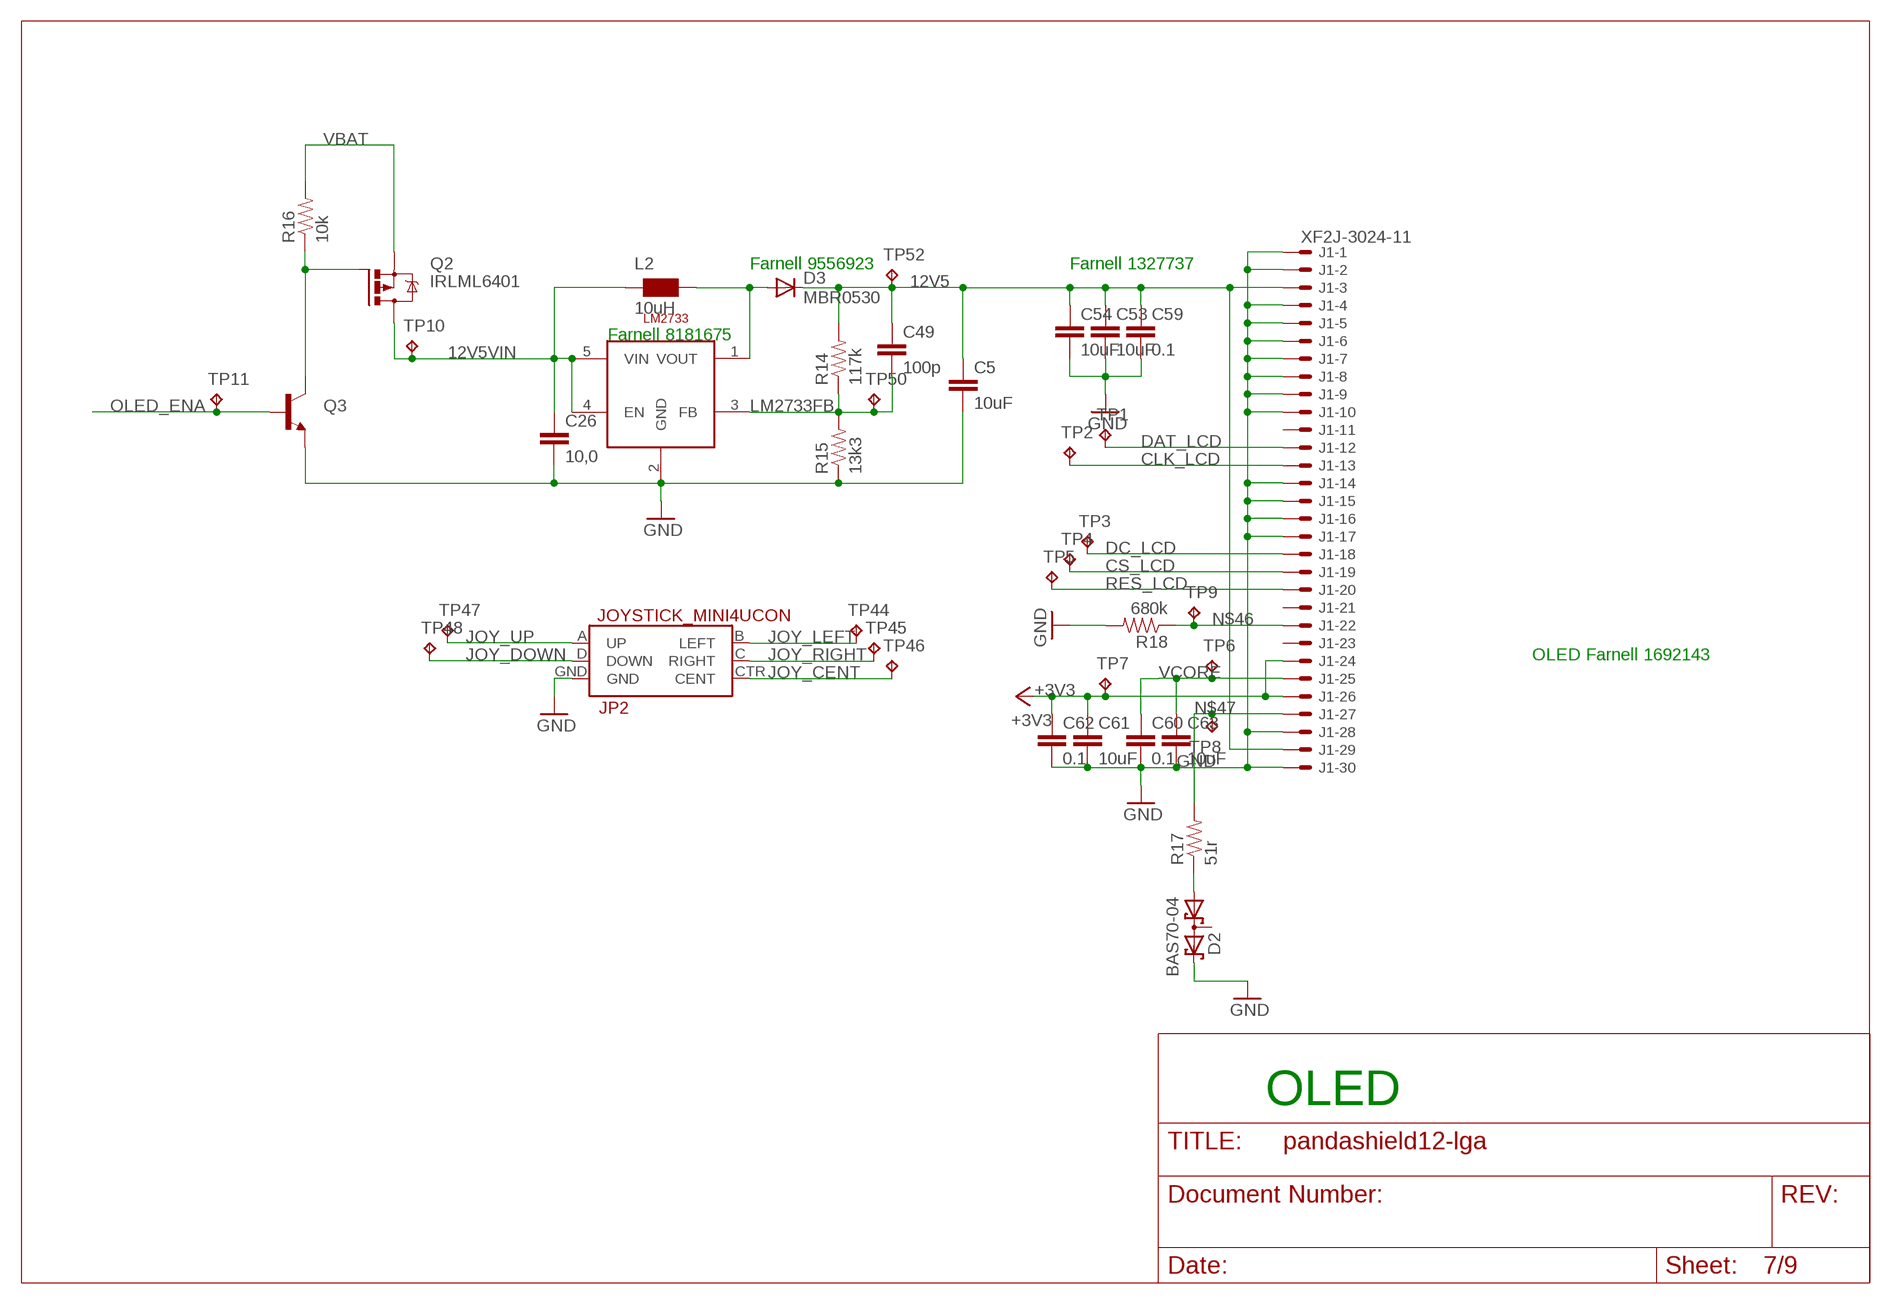
[diagram p6: schematic, sheet 7]

### Parts
C5  10uF  CAP1210  [1210]
C26  10,0  CAP1210  [1210]
C49  100p  CAP0603-CAP  [0603-CAP]
C53  10uF  CAP1210  [1210]
C54  10uF  CAP1210  [1210]
C59  0.1  CAP0603-CAP  [0603-CAP]
C60  0.1  CAP0603-CAP  [0603-CAP]
C61  10uF  CAP1210  [1210]
C62  0.1  CAP0603-CAP  [0603-CAP]
C63  10uF  CAP1210  [1210]
D2  BAS70-04  [SOT23]
D3  MBR0530  MBR0520LT  [SOD123]
J1  XF2J-3024-11  [XF2J-3024-11]
JP2  JOYSTICK_MINI4UCON  [JOYSTICK_MINI]
L2  10uH  WE-KIHQ_0805  [WE-KI_0805_B]
Q2  IRLML6401  IRLML5203  [MICRO3]
Q3  TRANSISTOR_NPNSOT23-3  [SOT23-3]
R14  117k  RESISTOR0603-RES  [0603-RES]
R15  13k3  RESISTOR0603-RES  [0603-RES]
R16  10k  RESISTOR0603-RES  [0603-RES]
R17  51r  RESISTOR0603-RES  [0603-RES]
R18  680k  RESISTOR0603-RES  [0603-RES]
TP1  TPB1,27  [B1,27]
TP2  TPB1,27  [B1,27]
TP3  TPB1,27  [B1,27]
TP4  TPB1,27  [B1,27]
TP5  TPB1,27  [B1,27]
TP6  TPB1,27  [B1,27]
TP7  TPB1,27  [B1,27]
TP8  TPB1,27  [B1,27]
TP9  TPB1,27  [B1,27]
TP10  TPB1,27  [B1,27]
TP11  TPB1,27  [B1,27]
TP44  TPB1,27  [B1,27]
TP45  TPB1,27  [B1,27]
TP46  TPB1,27  [B1,27]
TP47  TPB1,27  [B1,27]
TP48  TPB1,27  [B1,27]
TP50  TPB1,27  [B1,27]
TP52  TPB1,27  [B1,27]
U$2  LM2733  [SOT23-DBV]

### Nets
12V5: C5.1 C49.1 C53.1 C54.1 C59.1 D3.C J1.3 J1.29 R14.2 TP52.TP
12V5VIN [morepower]: C26.1 L2.2 Q2.3(D) TP10.TP U$2.4(EN) U$2.5(VIN)
+3V3 [morepower]: C61.1 C62.1 J1.24 J1.26 TP7.TP ; also sheet 1,2,4,5,6,8
CLK_LCD: J1.13 TP2.TP ; also sheet 6
CS_LCD: J1.19 TP4.TP ; also sheet 6
DAT_LCD: J1.12 TP1.TP ; also sheet 6
DC_LCD: J1.18 TP3.TP ; also sheet 6
GND [morepower]: C5.2 C26.2 C53.2 C54.2 C59.2 C60.2 C61.2 C62.2 C63.2 D2.2(C2) J1.1 J1.2 J1.4 J1.5 J1.6 J1.7 J1.8 J1.9 J1.10 J1.14 J1.15 J1.16 J1.17 J1.28 J1.30 JP2.GND Q3.2(E) R15.1 R18.2 U$2.2(GND) ; also sheet 1,2,3,4,5,6,8,9
JOY_CENT: JP2.CTR(CENT) TP46.TP ; also sheet 6
JOY_DOWN: JP2.D(DOWN) TP48.TP ; also sheet 6
JOY_LEFT: JP2.B(LEFT) TP44.TP ; also sheet 6
JOY_RIGHT: JP2.C(RIGHT) TP45.TP ; also sheet 6
JOY_UP: JP2.A(UP) TP47.TP ; also sheet 6
LM2733FB: C49.2 R14.1 R15.2 TP50.TP U$2.3(FB)
N$2: D2.1(A1) R17.1
N$13: Q2.1(G) Q3.3(C) R16.1
N$46: J1.22 R18.1 TP9.TP
N$47: J1.27 R17.2 TP8.TP
N$57: D3.A L2.1 U$2.1(VOUT)
OLED_ENA: Q3.1(B) TP11.TP ; also sheet 6
RES_LCD: J1.20 TP5.TP ; also sheet 6
VBAT [morepower]: Q2.2(S) R16.2 ; also sheet 2,3,4,5,6,9
VCORE: C60.1 C63.1 J1.25 TP6.TP
Unconnected: D2.3(C1A2) J1.11 J1.21 J1.23

### Notes on the sheet
- Farnell 9556923 | Farnell 1327737
- Farnell 8181675
- OLED Farnell 1692143
- OLED

## Sheet 8 of 9
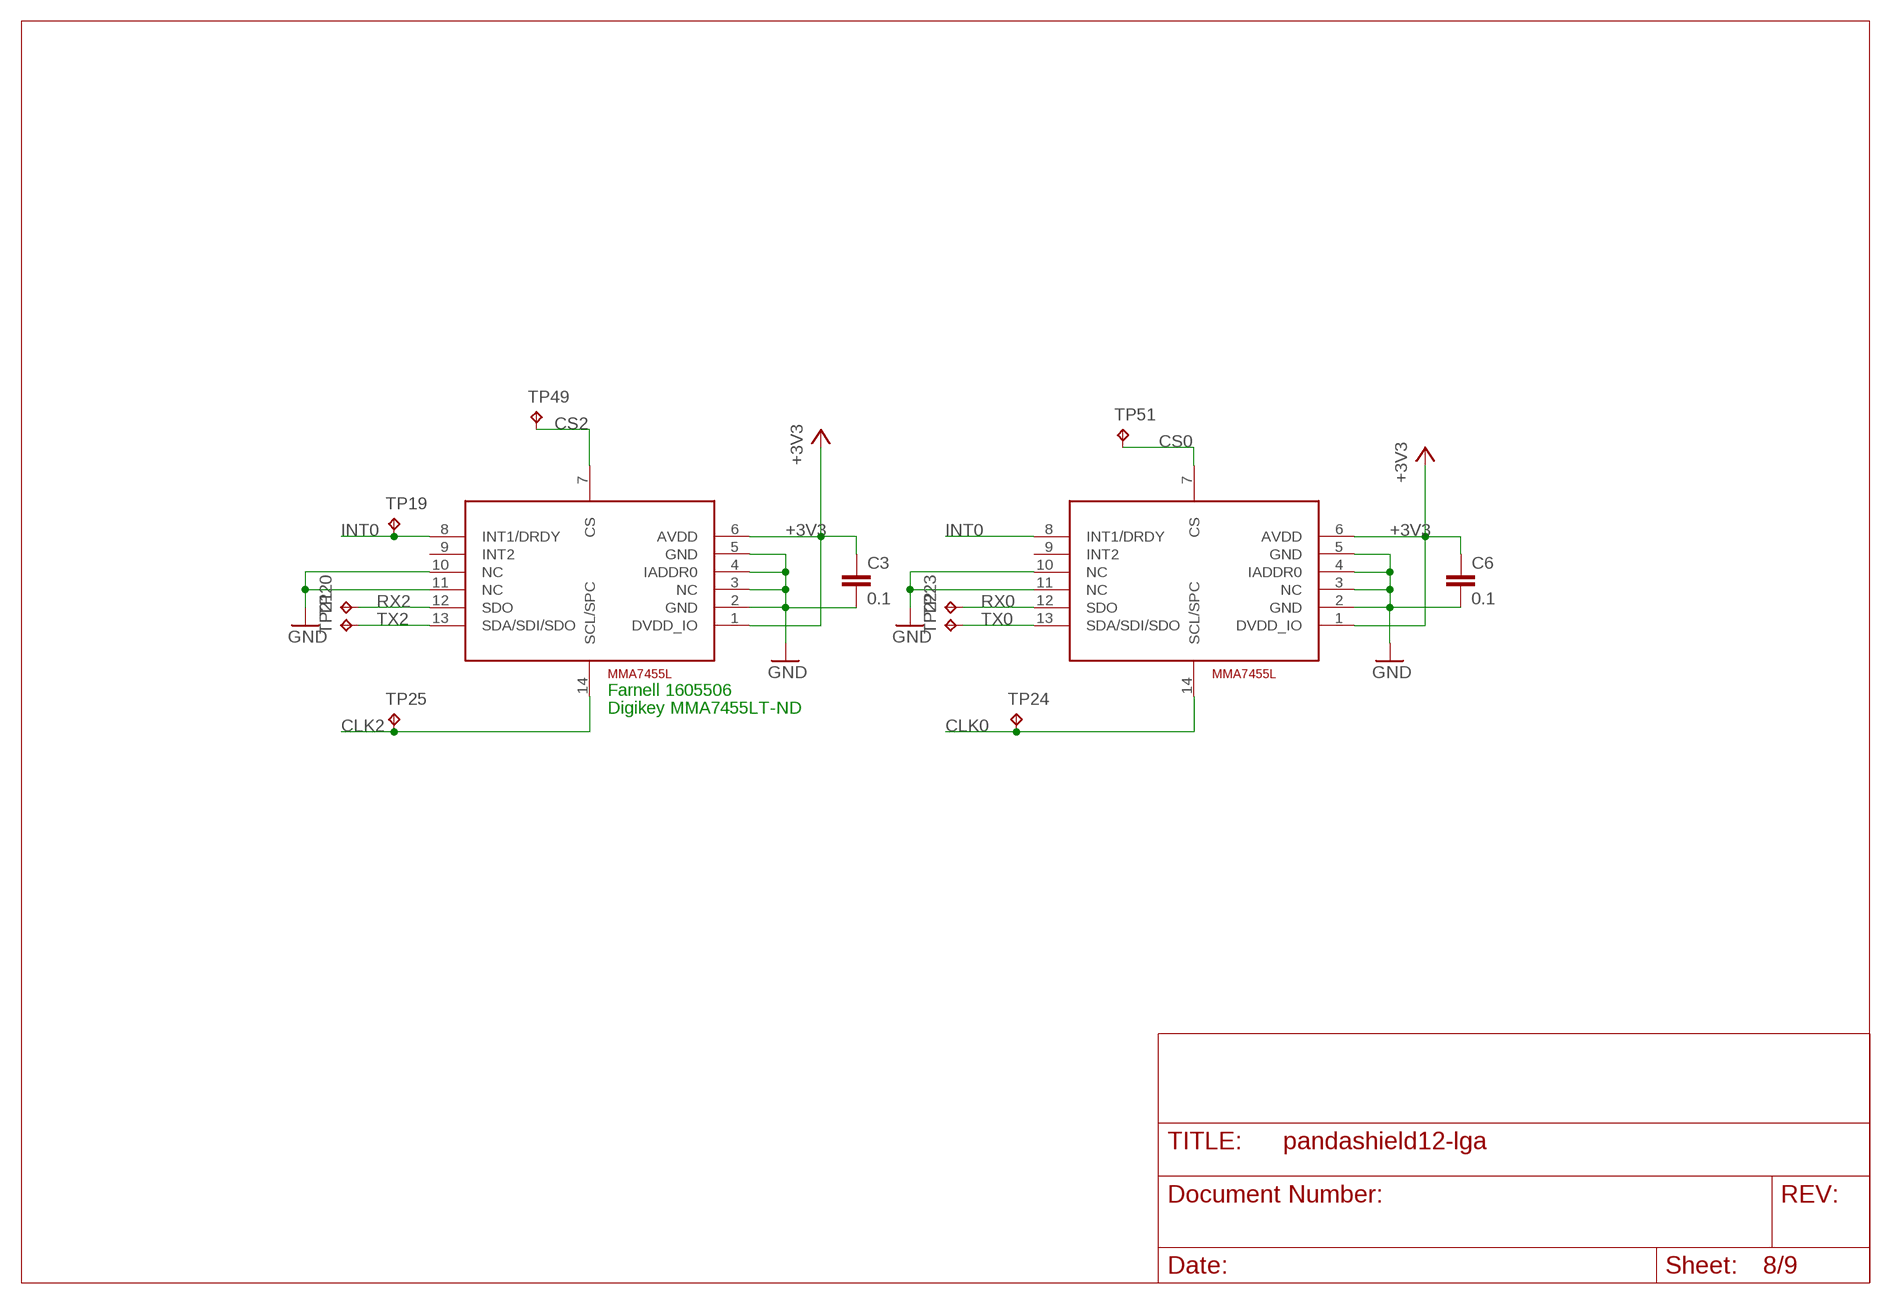
[diagram p7: schematic, sheet 8]

### Parts
C3  0.1  CAP0603-CAP  [0603-CAP]
C6  0.1  CAP0603-CAP  [0603-CAP]
TP19  TPB1,27  [B1,27]
TP20  TPB1,27  [B1,27]
TP21  TPB1,27  [B1,27]
TP22  TPB1,27  [B1,27]
TP23  TPB1,27  [B1,27]
TP24  TPB1,27  [B1,27]
TP25  TPB1,27  [B1,27]
TP49  TPB1,27  [B1,27]
TP51  TPB1,27  [B1,27]
U$5  MMA7455L  [LGA14]
U$6  MMA7455L  [LGA14]

### Nets
+3V3 [morepower]: C3.1 C6.1 U$5.1(DVDD_IO) U$5.6(AVDD) U$6.1(DVDD_IO) U$6.6(AVDD) ; also sheet 1,2,4,5,6,7
CLK0: TP24.TP U$6.14(SCL/SPC) ; also sheet 6
CLK2: TP25.TP U$5.14(SCL/SPC) ; also sheet 6
CS0: TP51.TP U$6.7(CS) ; also sheet 6
CS2: TP49.TP U$5.7(CS) ; also sheet 6
GND [morepower]: C3.2 C6.2 U$5.2(GND) U$5.3(NC) U$5.4(IADDR0) U$5.5(GND) U$5.10(NC) U$5.11(NC) U$6.2(GND) U$6.3(NC) U$6.4(IADDR0) U$6.5(GND) U$6.10(NC) U$6.11(NC) ; also sheet 1,2,3,4,5,6,7,9
INT0: TP19.TP U$5.8(INT1/DRDY) U$6.8(INT1/DRDY) ; also sheet 6
RX0: TP23.TP U$6.12(SDO) ; also sheet 6
RX2: TP20.TP U$5.12(SDO) ; also sheet 6
TX0: TP22.TP U$6.13(SDA/SDI/SDO) ; also sheet 6
TX2: TP21.TP U$5.13(SDA/SDI/SDO) ; also sheet 6
Unconnected: U$5.9(INT2) U$6.9(INT2)

### Notes on the sheet
- Farnell 1605506
- Digikey MMA7455LT-ND

## Sheet 9 of 9
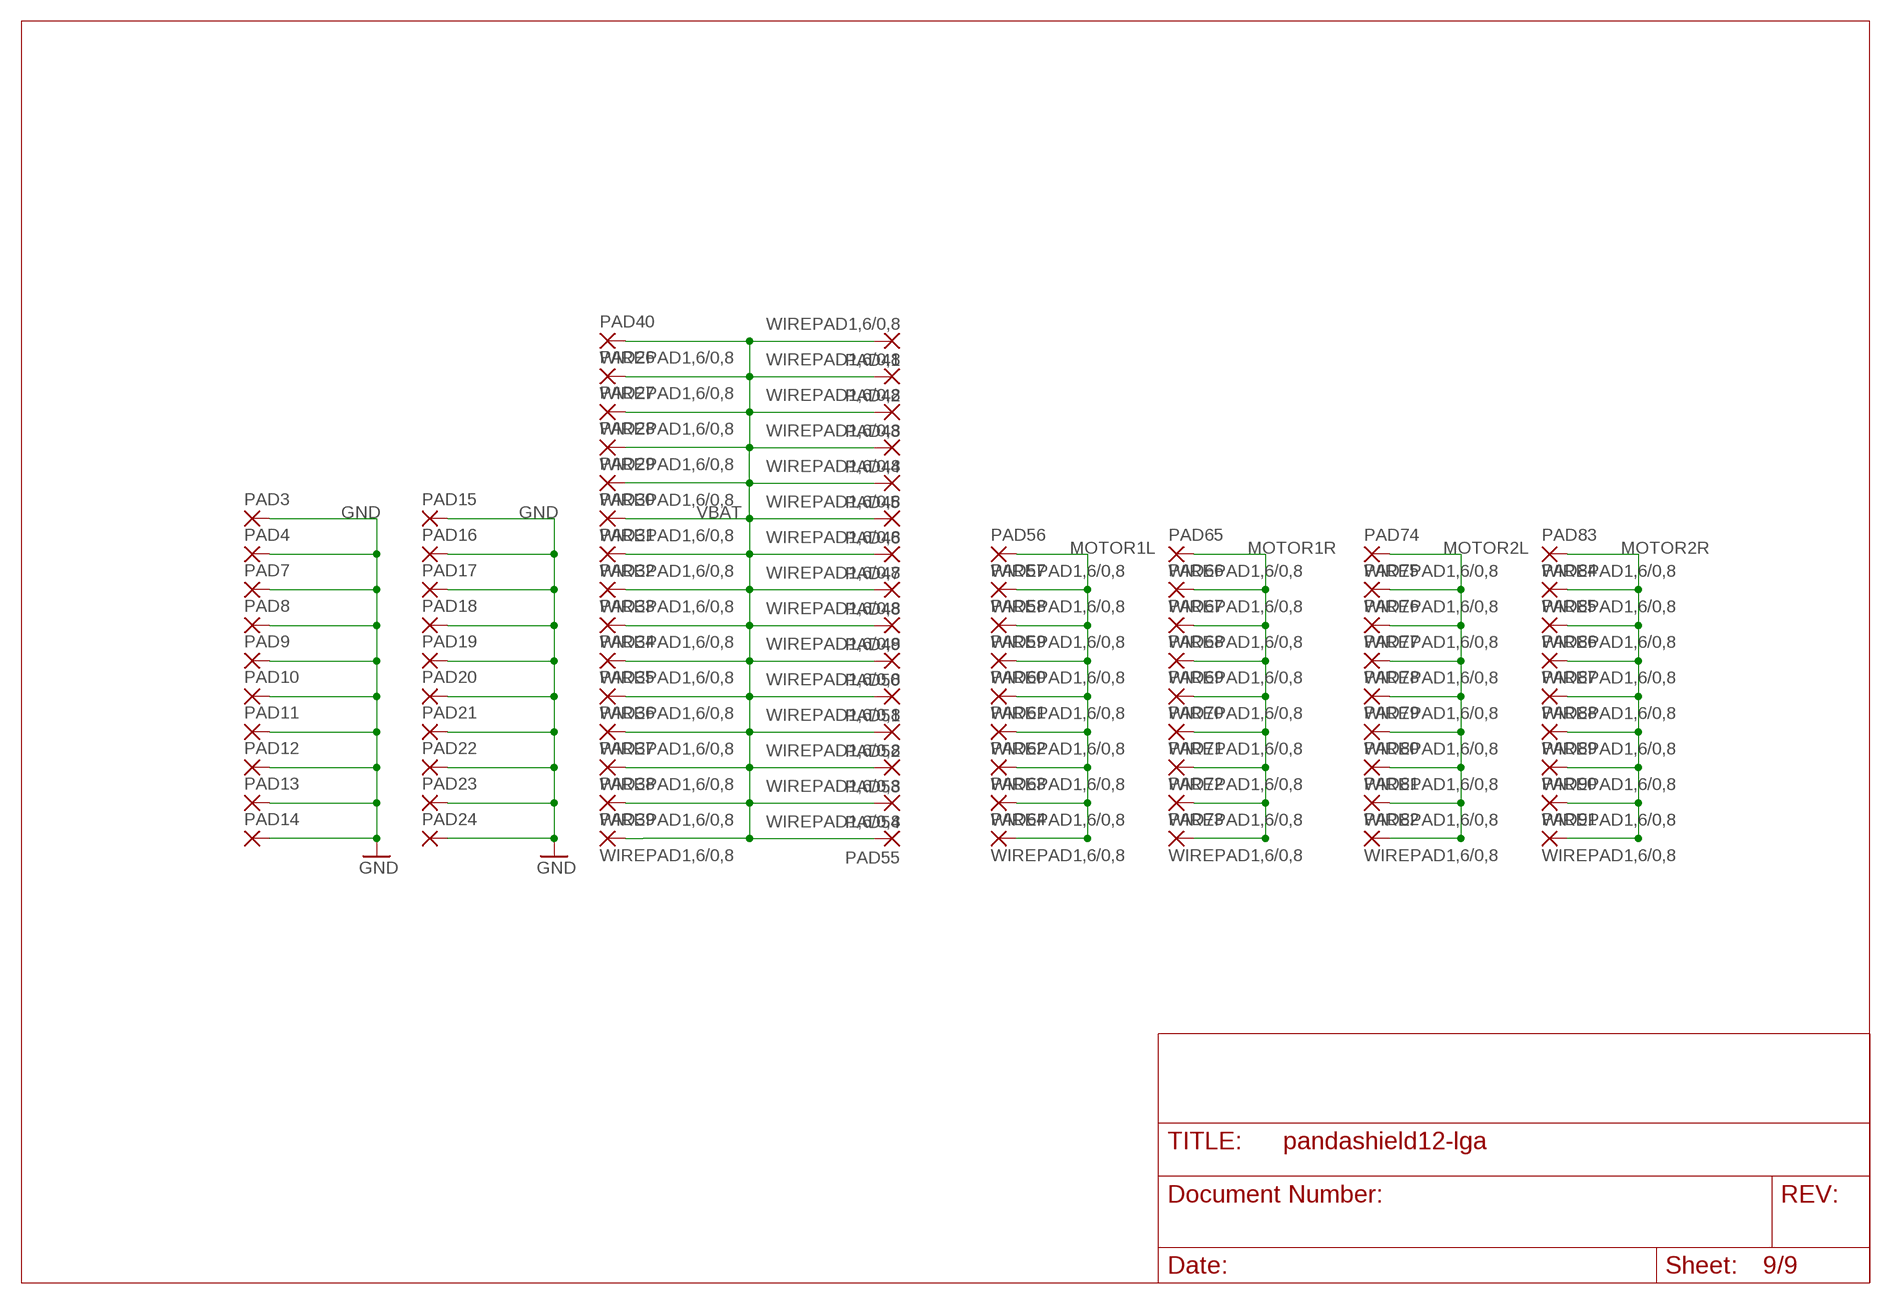
[diagram p8: schematic, sheet 9]

### Parts
PAD3  1,6/0,9  [1,6/0,9]
PAD4  1,6/0,9  [1,6/0,9]
PAD7  1,6/0,9  [1,6/0,9]
PAD8  1,6/0,9  [1,6/0,9]
PAD9  1,6/0,9  [1,6/0,9]
PAD10  1,6/0,9  [1,6/0,9]
PAD11  1,6/0,9  [1,6/0,9]
PAD12  1,6/0,9  [1,6/0,9]
PAD13  1,6/0,9  [1,6/0,9]
PAD14  1,6/0,9  [1,6/0,9]
PAD15  1,6/0,9  [1,6/0,9]
PAD16  1,6/0,9  [1,6/0,9]
PAD17  1,6/0,9  [1,6/0,9]
PAD18  1,6/0,9  [1,6/0,9]
PAD19  1,6/0,9  [1,6/0,9]
PAD20  1,6/0,9  [1,6/0,9]
PAD21  1,6/0,9  [1,6/0,9]
PAD22  1,6/0,9  [1,6/0,9]
PAD23  1,6/0,9  [1,6/0,9]
PAD24  1,6/0,9  [1,6/0,9]
PAD26  WIREPAD1,6/0,8  [1,6/0,8]
PAD27  WIREPAD1,6/0,8  [1,6/0,8]
PAD28  WIREPAD1,6/0,8  [1,6/0,8]
PAD29  WIREPAD1,6/0,8  [1,6/0,8]
PAD30  WIREPAD1,6/0,8  [1,6/0,8]
PAD31  WIREPAD1,6/0,8  [1,6/0,8]
PAD32  WIREPAD1,6/0,8  [1,6/0,8]
PAD33  WIREPAD1,6/0,8  [1,6/0,8]
PAD34  WIREPAD1,6/0,8  [1,6/0,8]
PAD35  WIREPAD1,6/0,8  [1,6/0,8]
PAD36  WIREPAD1,6/0,8  [1,6/0,8]
PAD37  WIREPAD1,6/0,8  [1,6/0,8]
PAD38  WIREPAD1,6/0,8  [1,6/0,8]
PAD39  WIREPAD1,6/0,8  [1,6/0,8]
PAD40  WIREPAD1,6/0,8  [1,6/0,8]
PAD41  WIREPAD1,6/0,8  [1,6/0,8]
PAD42  WIREPAD1,6/0,8  [1,6/0,8]
PAD43  WIREPAD1,6/0,8  [1,6/0,8]
PAD44  WIREPAD1,6/0,8  [1,6/0,8]
PAD45  WIREPAD1,6/0,8  [1,6/0,8]
PAD46  WIREPAD1,6/0,8  [1,6/0,8]
PAD47  WIREPAD1,6/0,8  [1,6/0,8]
PAD48  WIREPAD1,6/0,8  [1,6/0,8]
PAD49  WIREPAD1,6/0,8  [1,6/0,8]
PAD50  WIREPAD1,6/0,8  [1,6/0,8]
PAD51  WIREPAD1,6/0,8  [1,6/0,8]
PAD52  WIREPAD1,6/0,8  [1,6/0,8]
PAD53  WIREPAD1,6/0,8  [1,6/0,8]
PAD54  WIREPAD1,6/0,8  [1,6/0,8]
PAD55  WIREPAD1,6/0,8  [1,6/0,8]
PAD56  WIREPAD1,6/0,8  [1,6/0,8]
PAD57  WIREPAD1,6/0,8  [1,6/0,8]
PAD58  WIREPAD1,6/0,8  [1,6/0,8]
PAD59  WIREPAD1,6/0,8  [1,6/0,8]
PAD60  WIREPAD1,6/0,8  [1,6/0,8]
PAD61  WIREPAD1,6/0,8  [1,6/0,8]
PAD62  WIREPAD1,6/0,8  [1,6/0,8]
PAD63  WIREPAD1,6/0,8  [1,6/0,8]
PAD64  WIREPAD1,6/0,8  [1,6/0,8]
PAD65  WIREPAD1,6/0,8  [1,6/0,8]
PAD66  WIREPAD1,6/0,8  [1,6/0,8]
PAD67  WIREPAD1,6/0,8  [1,6/0,8]
PAD68  WIREPAD1,6/0,8  [1,6/0,8]
PAD69  WIREPAD1,6/0,8  [1,6/0,8]
PAD70  WIREPAD1,6/0,8  [1,6/0,8]
PAD71  WIREPAD1,6/0,8  [1,6/0,8]
PAD72  WIREPAD1,6/0,8  [1,6/0,8]
PAD73  WIREPAD1,6/0,8  [1,6/0,8]
PAD74  WIREPAD1,6/0,8  [1,6/0,8]
PAD75  WIREPAD1,6/0,8  [1,6/0,8]
PAD76  WIREPAD1,6/0,8  [1,6/0,8]
PAD77  WIREPAD1,6/0,8  [1,6/0,8]
PAD78  WIREPAD1,6/0,8  [1,6/0,8]
PAD79  WIREPAD1,6/0,8  [1,6/0,8]
PAD80  WIREPAD1,6/0,8  [1,6/0,8]
PAD81  WIREPAD1,6/0,8  [1,6/0,8]
PAD82  WIREPAD1,6/0,8  [1,6/0,8]
PAD83  WIREPAD1,6/0,8  [1,6/0,8]
PAD84  WIREPAD1,6/0,8  [1,6/0,8]
PAD85  WIREPAD1,6/0,8  [1,6/0,8]
PAD86  WIREPAD1,6/0,8  [1,6/0,8]
PAD87  WIREPAD1,6/0,8  [1,6/0,8]
PAD88  WIREPAD1,6/0,8  [1,6/0,8]
PAD89  WIREPAD1,6/0,8  [1,6/0,8]
PAD90  WIREPAD1,6/0,8  [1,6/0,8]
PAD91  WIREPAD1,6/0,8  [1,6/0,8]

### Nets
GND [morepower]: PAD3.1(P) PAD4.1(P) PAD7.1(P) PAD8.1(P) PAD9.1(P) PAD10.1(P) PAD11.1(P) PAD12.1(P) PAD13.1(P) PAD14.1(P) PAD15.1(P) PAD16.1(P) PAD17.1(P) PAD18.1(P) PAD19.1(P) PAD20.1(P) PAD21.1(P) PAD22.1(P) PAD23.1(P) PAD24.1(P) ; also sheet 1,2,3,4,5,6,7,8
MOTOR1L [morepower]: PAD56.1(P) PAD57.1(P) PAD58.1(P) PAD59.1(P) PAD60.1(P) PAD61.1(P) PAD62.1(P) PAD63.1(P) PAD64.1(P) ; also sheet 4
MOTOR1R [morepower]: PAD65.1(P) PAD66.1(P) PAD67.1(P) PAD68.1(P) PAD69.1(P) PAD70.1(P) PAD71.1(P) PAD72.1(P) PAD73.1(P) ; also sheet 4
MOTOR2L [morepower]: PAD74.1(P) PAD75.1(P) PAD76.1(P) PAD77.1(P) PAD78.1(P) PAD79.1(P) PAD80.1(P) PAD81.1(P) PAD82.1(P) ; also sheet 4
MOTOR2R [morepower]: PAD83.1(P) PAD84.1(P) PAD85.1(P) PAD86.1(P) PAD87.1(P) PAD88.1(P) PAD89.1(P) PAD90.1(P) PAD91.1(P) ; also sheet 4
VBAT [morepower]: PAD26.1(P) PAD27.1(P) PAD28.1(P) PAD29.1(P) PAD30.1(P) PAD31.1(P) PAD32.1(P) PAD33.1(P) PAD34.1(P) PAD35.1(P) PAD36.1(P) PAD37.1(P) PAD38.1(P) PAD39.1(P) PAD40.1(P) PAD41.1(P) PAD42.1(P) PAD43.1(P) PAD44.1(P) PAD45.1(P) PAD46.1(P) PAD47.1(P) PAD48.1(P) PAD49.1(P) PAD50.1(P) PAD51.1(P) PAD52.1(P) PAD53.1(P) PAD54.1(P) PAD55.1(P) ; also sheet 2,3,4,5,6,7

## Library data of the parts
5V = con-amp-quick:M02: AMP QUICK CONNECTOR
10UF/16V C1 C2 C12-C14 C25 C100 = rcl:CPOL-EU: POLARIZED CAPACITOR, European symbol
C3 C5-C8 C17 C19-C21 C26 C28 C29 C32 C41-C43 C45-C49 C53 C54 C59-C64 = SparkFun:CAP: Capacitor Standard 0603 ceramic capacitor, and 0.1" leaded capacitor.
C4 C9-C11 C15 C16 C18 C22-C24 C27 C30 C31 C36 C51 C52 C55-C58 C71 C72 = rcl:C-EU: CAPACITOR, European symbol
C33 = resistor:CPOL-EU: POLARIZED CAPACITOR, European symbol
CHGLED1 CHGLED2 LED1-LED9 = led:LED: LED OSRAM: - CHIPLED LG R971, LG N971, LY N971, LG Q971, LY Q971, LO R971, LY R971 LH N974, LH R974 LS Q976, LO Q976, LY Q976 LO Q996 - Hyper CHIPLED LW Q18S LB Q993, LB Q99A, LB R99A - SideLED LS A670, LO A670, LY A670, LG A670, LP A670 LB A673, LV A673, LT A673, LW A673 LH A674 LY A675 LS A676, LA A676, LO A676, LY A676, LW A676 LS A679, LY A679, LG A679 - Hyper Micro SIDELED® LS Y876, LA Y876, LO Y876, LY Y876 LT Y87S - SmartLED LW L88C, LW L88S LB L89C, LB L89S, LG L890 LS L89K, LO L89K, LY L89K LS L896, LA L896, LO L896, LY L896 - TOPLED LS T670, LO T670, LY T670, LG T670, LP T670 LSG T670, LSP T670, LSY T670, LOP T670, LYG T670 LG T671, LOG T671, LSG T671 LB T673, LV T673, LT T673, LW T673 LH T674 LS T676, LA T676, LO T676, LY T676, LB T676, LH T676, LSB T676, LW T676 LB T67C, LV T67C, LT T67C, LS T67K, LO T67K, LY T67K, LW E67C LS E67B, LA E67B, LO E67B, LY E67B, LB E67C, LV E67C, LT E67C LW T67C LS T679, LY T679, LG T679 LS T770, LO T770, LY T770, LG T770, LP T770 LB T773, LV T773, LT T773, LW T773 LH T774 LS E675, LA E675, LY E675, LS T675 LS T776, LA T776, LO T776, LY T776, LB T776 LHGB T686 LT T68C, LB T68C - Hyper Mini TOPLED® LB M676 - Mini TOPLED Santana® LG M470 LS M47K, LO M47K, LY M47K Source: http://www.osram.convergy.de LUXEON: - LUMILED® LXK2-PW12-R00, LXK2-PW12-S00, LXK2-PW14-U00, LXK2-PW14-V00 LXK2-PM12-R00, LXK2-PM12-S00, LXK2-PM14-U00 LXK2-PE12-Q00, LXK2-PE12-R00, LXK2-PE12-S00, LXK2-PE14-T00, LXK2-PE14-U00 LXK2-PB12-K00, LXK2-PB12-L00, LXK2-PB12-M00, LXK2-PB14-N00, LXK2-PB14-P00, LXK2-PB14-Q00 LXK2-PR12-L00, LXK2-PR12-M00, LXK2-PR14-Q00, LXK2-PR14-R00 LXK2-PD12-Q00, LXK2-PD12-R00, LXK2-PD12-S00 LXK2-PH12-R00, LXK2-PH12-S00 LXK2-PL12-P00, LXK2-PL12-Q00, LXK2-PL12-R00 Source: www.luxeon.com KINGBRIGHT: KA-3528ASYC Source: www.kingbright.com
COILGUN = con-lstb:MA04-1: PIN HEADER
D1 = diode:ES2D: DIODE super fast rectifier, 2 A
D2 = diode:BAS70-04: Silicon Schottky Diodes General-purpose diode for high-speed switching
D3 = diode:MBR0520LT: SCHOTTKY BARRIER RECTIFIER Source: http://onsemi.com .. MBR0520LT1-D.pdf
D4 D100 = diode:BAT54: Schottky Diodes Source: Fairchild .. BAT54.pdf
GND GND78 PAD1 PAD2 PAD5 PAD6 VBAT = wirepad:3,81/1,4: THROUGH-HOLE PAD
IC1 = texas:TPS773*: 250-mA LDO REGULATORS WITH RESET OUTPUT WITH 8-PIN MSOP PACKAGING Source: http://focus.ti.com/lit/ds/symlink/tps77333.pdf; MF: TEXAS INSTRUMENT CONNECTORS; MPN: TPS77350DGK; OC_FARNELL: 1412894; OC_NEWARK: 77C1226
IC2 IC6 = st-microelectronics:VNH3ASP30-E: FULLY INTEGRATED H-BRIDGE MOTOR DRIVER Source: http://pdf1.alldatasheet.com/datasheet-pdf/view/84563/STMICROELECTRONICS/VNH3SP30.html
IC3 = telcom:TCM809: POWER SUPPLY MONITOR replacement for Maxim MAX809 and MAX810
IC8 = national-semiconductor:LM2936MP?*: Ultra-Low Quiescent Current LDO Voltage Regulator Source: Data sheet <http://www.national.com/ds/LM/LM2936.pdf>; MF: NATIONAL SEMICONDUCTOR; MPN: LM2936MP-3.0/NOPB; OC_FARNELL: 1496125; OC_NEWARK: 41K4522
J1 = con-omron:XF2*-30?: OMRON FPC Connector Source : http://www.omron.com/ecb/products/pdf/fpc.pdf; MPN: XF2J-3024-11; OC_FARNELL: 1430938; OC_NEWARK: 37M0856
J3 J6 = pinhead:PINHD-2X14: PIN HEADER
J4 J5 = con-omron:XF2*-06?: OMRON FPC Connector Source : http://www.omron.com/ecb/products/pdf/fpc.pdf; MF: OMRON COMPONENTS USA; MPN: XF2L-0625-1; OC_FARNELL: 1536105; OC_NEWARK: 29C7842
JP1 = pinhead:PINHD-2X7: PIN HEADER
JP2 = SparkFun:JOYSTICK_MINI
L2 L3 = wuerth-elektronik:WE-KIHQ: SMD Wire Wound Ceramic Inductor WE-KIHQ - High current - Highest Quality factor in size 0805 - up to 98 - High thermal stability - High SRF -- Bluetooth -- Wireless LAN -- RF oscillation circuit -- IF impedance matching -- IG choke
LSP1 LSP2 = solpad:LSP11: SOLDER PAD drill 1.1 mm
LT3750 = mylbr:LT3750
MCU = renesas_mcu:R32C111
PAD3 PAD4 PAD7-PAD25 = wirepad:1,6/0,9: THROUGH-HOLE PAD
PAD26-PAD91 = wirepad:WIREPAD: Wire PAD connect wire on PCB
PANDA = con-amp-quick:MA03: AMP QUICK CONNECTOR
Q1 = crystal:CRYSTAL: CRYSTAL
Q2 Q4 Q5 = transistor-power:IRLML5203: HEXFET P-Channel Power MOSFET
Q3 = SparkFun:TRANSISTOR_NPN: Transistor NPN BJT configuration in SOT23 package. MMBT2222 is the common NPN we use. Double check BCE configuration again layout.
R1-R7 R9 R10 R12-R19 R21-R25 R27-R34 R36 R39-R42 R47 R56 R58 = SparkFun:RESISTOR: Resistor Basic schematic elements and footprints for 0603, 1206, and PTH resistors.
R8 R20 R44-R46 R48 R50 R51 R53 R61 R62 = rcl:R-EU_: RESISTOR, European symbol
R11 R26 R35 R37 = resistor:R-EU_: RESISTOR, European symbol
R57 R59 R60 = rcl:R-US_: RESISTOR, American symbol
SG2 = SparkFun:BUZZER: Buzzer 12mm Spark Fun Electronics SKU : Comp-Buzzer
TP1-TP65 = testpad:TP: Test pad
U1 = adafruit:TXB0108PWR: 8-Bit Bi-Directional Level Shifter 1.2V-3.6V (VCCA) to 1.65V-5.5V (VCCB) bi-directional level shifter with auto direction sensing. Max data rate - VCCA 1.8V: 20Mbps (50ns), VCCA 3.3V: 100Mbps (10ns) Digikey: 296-21527-1-ND
U2 = SparkFun:L3G4200D: L3G4200D Three-axis, digital output gyroscope The L3G4200D is a low-power three-axis angular rate sensor, has a full scale of ±250/±500/±2000 dps and is capable of measuring rates with a user-selectable bandwidth. It includes a sensing element and an IC interface capable of providing the measured angular rate to the external world through a digital interface (I2C/SPI). Package: 4x4x1.1 LGA-16 (LGA16-4x4.PAC)
U$1 = samuel:DA2032-ALB
U$2 = texas:LM2733
U$3 = tonu:TPS54332
U$5 U$6 = samuel:MMA7455L
U$100 = SparkFun:INDUCTOR: Inductors Basic Inductor/Choke - 0603 and 1206. Footprints are not proven and vary greatly between part numbers.
U$102 = tonu:IRF8252
X4 = SparkFun:USB: USB Connectors USB-B-PTH is fully proven SKU : PRT-00139 USB-miniB is fully proven SKU : PRT-00587 USB-A-PCB is untested. USB-A-H is throughly reviewed, but untested. Spark Fun Electronics SKU : PRT-00437 USB-B-SMT is throughly reviewed, but untested. Needs silkscreen touching up. USB-A-S has not been used/tested USB-MB-H has not been used/tested
X7 = farnell:SDBMF: SD MEMORY CARD PUSH-PUSH WITH CONNECTOR TYPE B (BIG SWUÌTCH #3) KINGFONT PRECISION INDUSTIAL CO., LTD Source: http://www.farnell.com/datasheets/74273.pdf Best.-Nr.: 9186174 Hersteller: MULTICOMP Herstellerbez.: SDBMF-00915B0T2
Y2 = SparkFun:RESONATOR: Resonator Small SMD resonator. This is the itty bitty 10/20MHz resonators with built in caps. CSTCE10M0G55 and CSTCE20M0V53. Footprint has been reviewed closely but hasn't been tested yet.

## Net classes
0 default: width 0.203 mm, drill 0.152 mm, clearance 0.203 mm
1 power: width 0.635 mm, drill 0.305 mm, clearance 0.203 mm
2 morepower: width 1.016 mm, drill 0.508 mm, clearance 0.203 mm